# Altium project 主板.PrjPcb
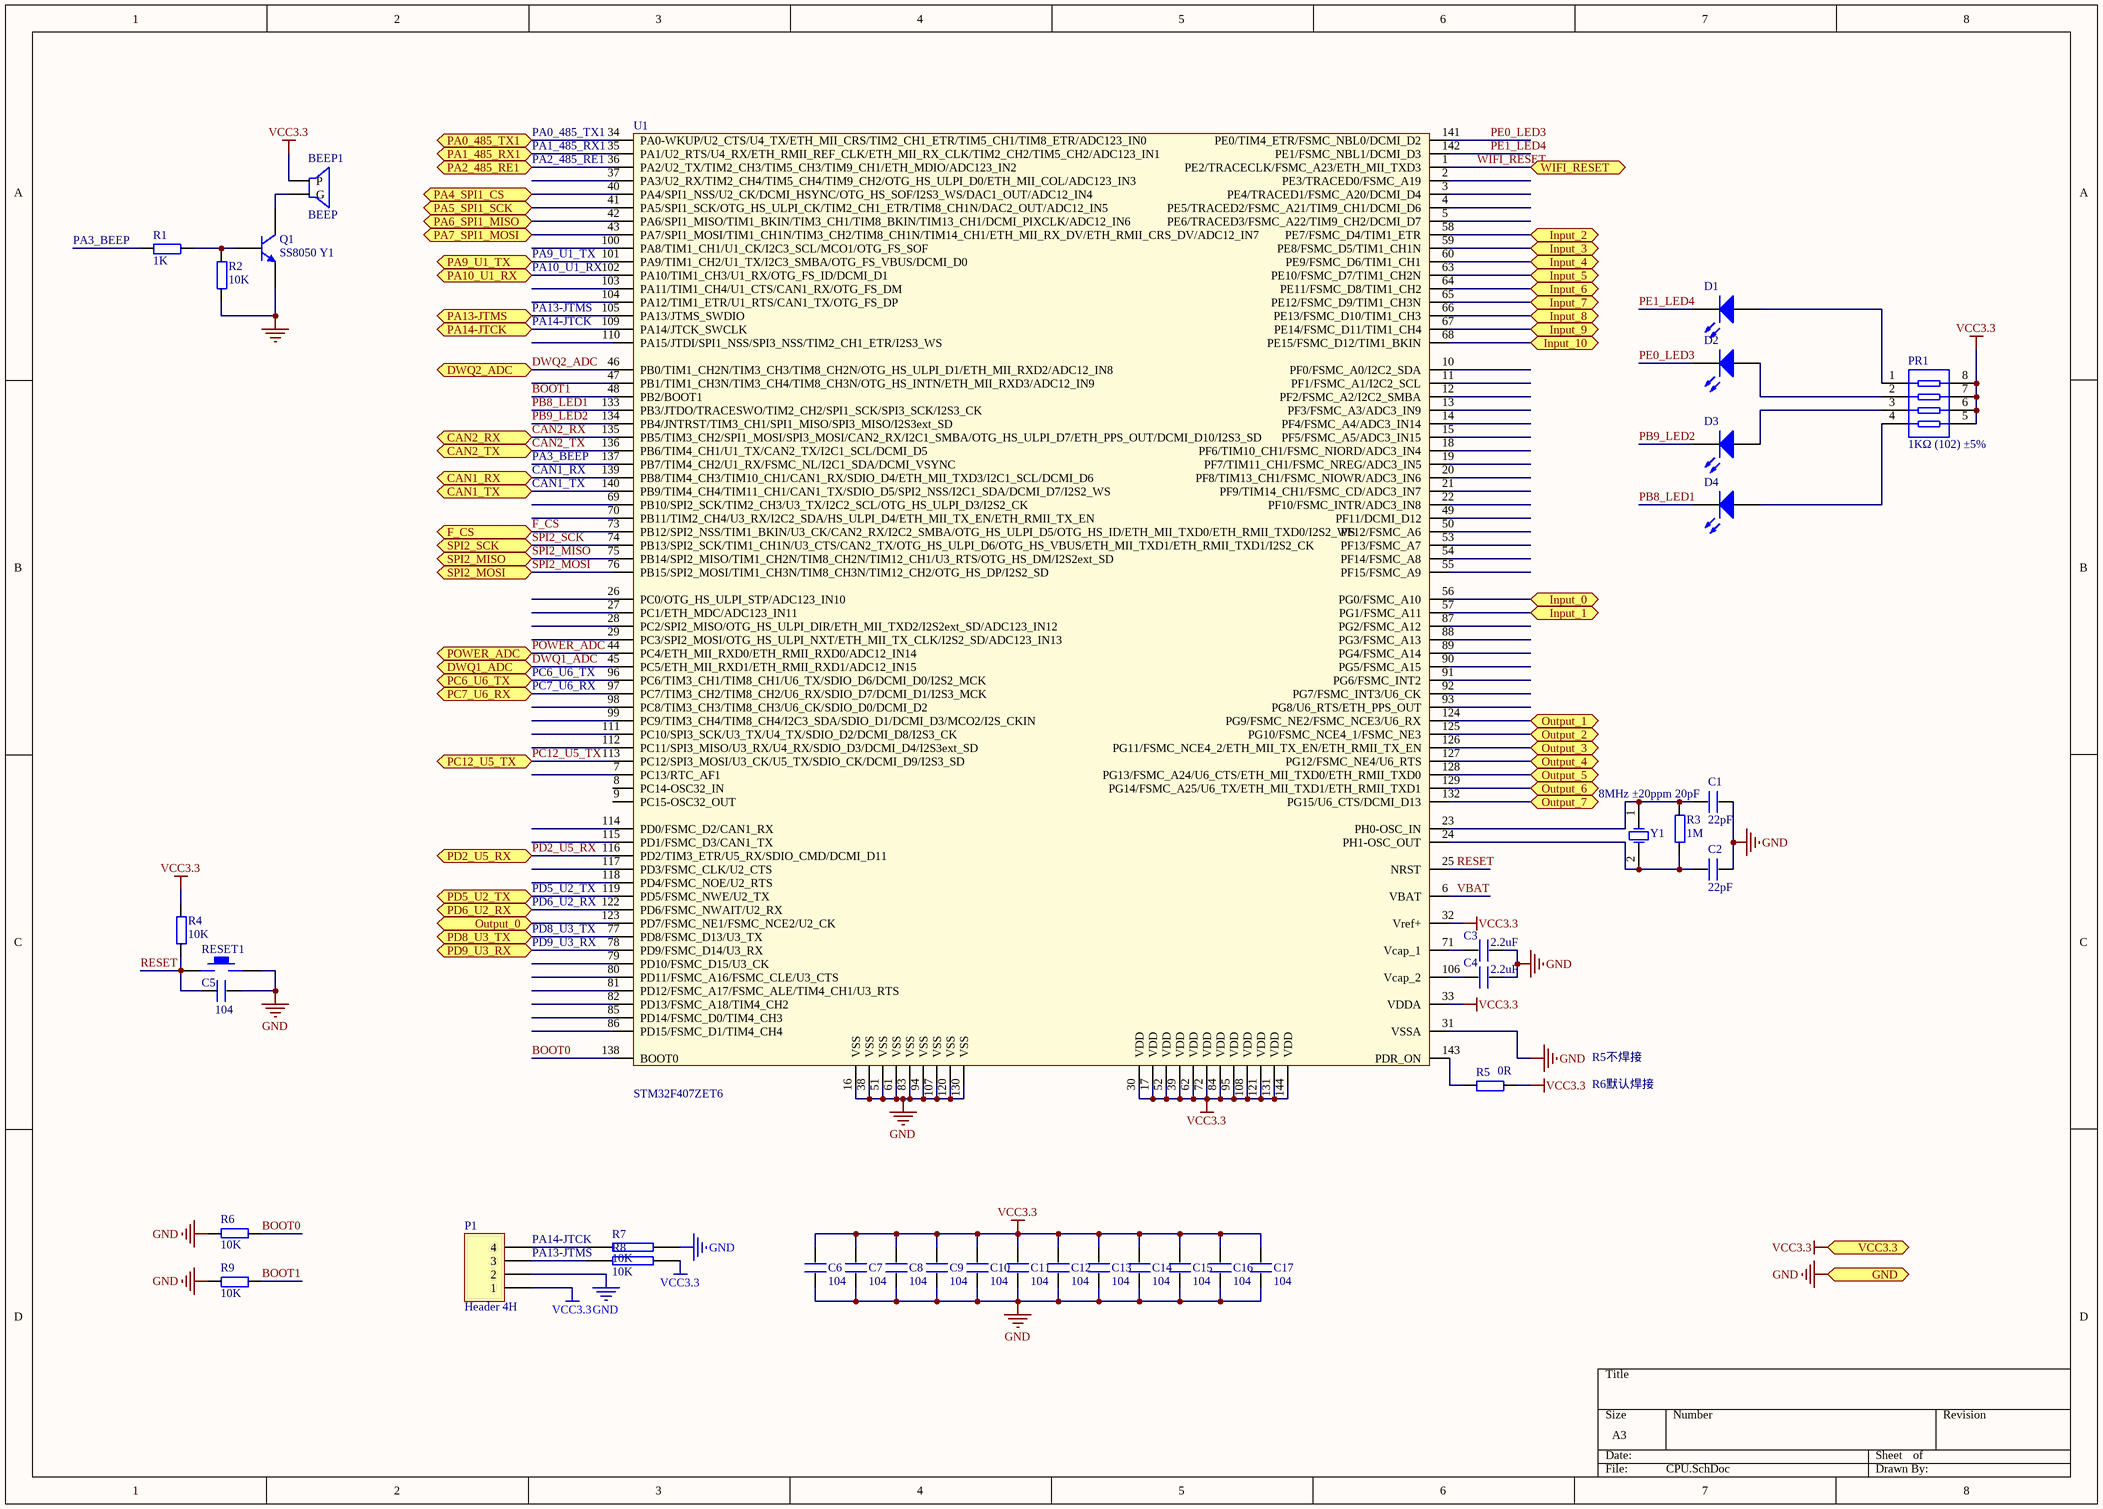
[diagram p0: CPU.SchDoc]
6 sheets, 286 parts. Net scope: flat (ports and power ports of the same name join across sheets).
Board file: PCB1.PcbDoc
Sheets:
  CPU.SchDoc
  通讯外设.SchDoc
  IO.SchDoc
  电源.SchDoc
  语音.SchDoc
  端子图.SchDoc

## Sheet CPU.SchDoc
size A3

### Parts
BEEP1  BEEP  [BELL-5]
C1  22pF  [0603_C]
C2  22pF  [0603_C]
C3  2.2uF  [0603_C]
C4  2.2uF  [0603_C]
C5  104  [0603_C]
C6  104  [0603_C]
C7  104  [0603_C]
C8  104  [0603_C]
C9  104  [0603_C]
C10  104  [0603_C]
C11  104  [0603_C]
C12  104  [0603_C]
C13  104  [0603_C]
C14  104  [0603_C]
C15  104  [0603_C]
C16  104  [0603_C]
C17  104  [0603_C]
D1  红灯 0805  [LC-0805_LED_S1]  (value not drawn)
D2  红灯 0805  [LC-0805_LED_S1]  (value not drawn)
D3  红灯 0805  [LC-0805_LED_S1]  (value not drawn)
D4  红灯 0805  [LC-0805_LED_S1]  (value not drawn)
P1  Header 4H  [IDE4]
PR1  1KΩ (102) ±5%  [0603_Rx4]
Q1  SS8050 Y1  [SOT-23(SOT-23-3)]
R1  1K  [0603_R]
R2  10K  [0603_R]
R3  1M  [0603_R]
R4  10K  [0603_R]
R5  0R  [0603_R]
R6  10K  [0603_R]
R7  10K  [0603_R]
R8  10K  [0603_R]
R9  10K  [0603_R]
RESET1  KEY_M  [SW_PB2_A1]  (value not drawn)
U1  STM32F407ZET6  [LQFP-144_20x20x05P]
Y1  8MHz ±20ppm 20pF  [SMD-5032_2P]

### Ports
CAN1_RX, CAN1_TX, CAN2_RX, CAN2_TX, DWQ1_ADC, DWQ2_ADC, F_CS, GND, Input_0, Input_1, Input_2, Input_3, Input_4, Input_5, Input_6, Input_7, Input_8, Input_9, Input_10, Output_0, Output_1, Output_2, Output_3, Output_4, Output_5, Output_6, Output_7, PA0_485_TX1, PA1_485_RX1, PA2_485_RE1, PA4_SPI1_CS, PA5_SPI1_SCK, PA6_SPI1_MISO, PA7_SPI1_MOSI, PA9_U1_TX, PA10_U1_RX, PA13-JTMS, PA14-JTCK, PC6_U6_TX, PC7_U6_RX, PC12_U5_TX, PD2_U5_RX, PD5_U2_TX, PD6_U2_RX, PD8_U3_TX, PD9_U3_RX, POWER_ADC, SPI2_MISO, SPI2_MOSI, SPI2_SCK, VCC3.3, WIFI_RESET

### Nets
GND: C1.1 C2.1 C3.2 C4.2 C5.2 C6.1 C7.1 C8.1 C9.1 C10.1 C11.1 C12.1 C13.1 C14.1 C15.1 C16.1 C17.1 P1.2 Q1.2(E) R2.1 R6.2 R7.1 R9.1 RESET1.2 U1.16(VSS) U1.31(VSSA) U1.38(VSS) U1.51(VSS) U1.61(VSS) U1.83(VSS) U1.94(VSS) U1.107(VSS) U1.120(VSS) U1.130(VSS) ; port GND
VCC3.3: BEEP1.1(P) C6.2 C7.2 C8.2 C9.2 C10.2 C11.2 C12.2 C13.2 C14.2 C15.2 C16.2 C17.2 P1.1 PR1.5 PR1.6 PR1.7 PR1.8 R4.2 R5.2 R8.1 U1.17(VDD) U1.30(VDD) U1.32(Vref+) U1.33(VDDA) U1.39(VDD) U1.52(VDD) U1.62(VDD) U1.72(VDD) U1.84(VDD) U1.95(VDD) U1.108(VDD) U1.121(VDD) U1.131(VDD) U1.144(VDD) ; port VCC3.3
BOOT0: R6.1 U1.138(BOOT0)
BOOT1: R9.2 U1.48(PB2/BOOT1)
CAN1_RX: U1.139(PB8/TIM4_CH3/TIM10_CH1/CAN1_RX/SDIO_D4/ETH_MII_TXD3/I2C1_SCL/DCMI_D6) ; port CAN1_RX
CAN1_TX: U1.140(PB9/TIM4_CH4/TIM11_CH1/CAN1_TX/SDIO_D5/SPI2_NSS/I2C1_SDA/DCMI_D7/I2S2_WS) ; port CAN1_TX
CAN2_RX: U1.135(PB5/TIM3_CH2/SPI1_MOSI/SPI3_MOSI/CAN2_RX/I2C1_SMBA/OTG_HS_ULPI_D7/ETH_PPS_OUT/DCMI_D10/I2S3_SD) ; port CAN2_RX
CAN2_TX: U1.136(PB6/TIM4_CH1/U1_TX/CAN2_TX/I2C1_SCL/DCMI_D5) ; port CAN2_TX
DWQ1_ADC: U1.45(PC5/ETH_MII_RXD1/ETH_RMII_RXD1/ADC12_IN15) ; port DWQ1_ADC
DWQ2_ADC: U1.46(PB0/TIM1_CH2N/TIM3_CH3/TIM8_CH2N/OTG_HS_ULPI_D1/ETH_MII_RXD2/ADC12_IN8) ; port DWQ2_ADC
F_CS: U1.73(PB12/SPI2_NSS/TIM1_BKIN/U3_CK/CAN2_RX/I2C2_SMBA/OTG_HS_ULPI_D5/OTG_HS_ID/ETH_MII_TXD0/ETH_RMII_TXD0/I2S2_WS) ; port F_CS
PA0_485_TX1: U1.34(PA0-WKUP/U2_CTS/U4_TX/ETH_MII_CRS/TIM2_CH1_ETR/TIM5_CH1/TIM8_ETR/ADC123_IN0) ; port PA0_485_TX1
PA1_485_RX1: U1.35(PA1/U2_RTS/U4_RX/ETH_RMII_REF_CLK/ETH_MII_RX_CLK/TIM2_CH2/TIM5_CH2/ADC123_IN1) ; port PA1_485_RX1
PA2_485_RE1: U1.36(PA2/U2_TX/TIM2_CH3/TIM5_CH3/TIM9_CH1/ETH_MDIO/ADC123_IN2) ; port PA2_485_RE1
PA3_BEEP: R1.1 U1.137(PB7/TIM4_CH2/U1_RX/FSMC_NL/I2C1_SDA/DCMI_VSYNC)
PA9_U1_TX: U1.101(PA9/TIM1_CH2/U1_TX/I2C3_SMBA/OTG_FS_VBUS/DCMI_D0) ; port PA9_U1_TX
PA10_U1_RX: U1.102(PA10/TIM1_CH3/U1_RX/OTG_FS_ID/DCMI_D1) ; port PA10_U1_RX
PA13-JTMS: P1.3 R8.2 U1.105(PA13/JTMS_SWDIO) ; port PA13-JTMS
PA14-JTCK: P1.4 R7.2 U1.109(PA14/JTCK_SWCLK) ; port PA14-JTCK
PB8_LED1: D4.K U1.133(PB3/JTDO/TRACESWO/TIM2_CH2/SPI1_SCK/SPI3_SCK/I2S3_CK)
PB9_LED2: D3.K U1.134(PB4/JNTRST/TIM3_CH1/SPI1_MISO/SPI3_MISO/I2S3ext_SD)
PC6_U6_TX: U1.96(PC6/TIM3_CH1/TIM8_CH1/U6_TX/SDIO_D6/DCMI_D0/I2S2_MCK) ; port PC6_U6_TX
PC7_U6_RX: U1.97(PC7/TIM3_CH2/TIM8_CH2/U6_RX/SDIO_D7/DCMI_D1/I2S3_MCK) ; port PC7_U6_RX
PC12_U5_TX: U1.113(PC12/SPI3_MOSI/U3_CK/U5_TX/SDIO_CK/DCMI_D9/I2S3_SD) ; port PC12_U5_TX
PD2_U5_RX: U1.116(PD2/TIM3_ETR/U5_RX/SDIO_CMD/DCMI_D11) ; port PD2_U5_RX
PD5_U2_TX: U1.119(PD5/FSMC_NWE/U2_TX) ; port PD5_U2_TX
PD6_U2_RX: U1.122(PD6/FSMC_NWAIT/U2_RX) ; port PD6_U2_RX
PD8_U3_TX: U1.77(PD8/FSMC_D13/U3_TX) ; port PD8_U3_TX
PD9_U3_RX: U1.78(PD9/FSMC_D14/U3_RX) ; port PD9_U3_RX
PE0_LED3: D2.K U1.141(PE0/TIM4_ETR/FSMC_NBL0/DCMI_D2)
PE1_LED4: D1.K U1.142(PE1/FSMC_NBL1/DCMI_D3)
POWER_ADC: U1.44(PC4/ETH_MII_RXD0/ETH_RMII_RXD0/ADC12_IN14) ; port POWER_ADC
RESET: C5.1 R4.1 RESET1.1 U1.25(NRST)
SPI2_MISO: U1.75(PB14/SPI2_MISO/TIM1_CH2N/TIM8_CH2N/TIM12_CH1/U3_RTS/OTG_HS_DM/I2S2ext_SD) ; port SPI2_MISO
SPI2_MOSI: U1.76(PB15/SPI2_MOSI/TIM1_CH3N/TIM8_CH3N/TIM12_CH2/OTG_HS_DP/I2S2_SD) ; port SPI2_MOSI
SPI2_SCK: U1.74(PB13/SPI2_SCK/TIM1_CH1N/U3_CTS/CAN2_TX/OTG_HS_ULPI_D6/OTG_HS_VBUS/ETH_MII_TXD1/ETH_RMII_TXD1/I2S2_CK) ; port SPI2_SCK
VBAT: U1.6(VBAT)
WIFI_RESET: U1.1(PE2/TRACECLK/FSMC_A23/ETH_MII_TXD3) ; port WIFI_RESET
NetBEEP1_2: BEEP1.2(G) Q1.3(C)
NetC1_2: C1.2 R3.2 U1.23(PH0-OSC_IN) Y1.1(OSC1)
NetC2_2: C2.2 R3.1 U1.24(PH1-OSC_OUT) Y1.2(OSC2)
NetC3_1: C3.1 U1.71(Vcap_1)
NetC4_1: C4.1 U1.106(Vcap_2)
NetD1_A: D1.A PR1.1
NetD2_A: D2.A PR1.2
NetD3_A: D3.A PR1.3
NetD4_A: D4.A PR1.4
NetQ1_1: Q1.1(B) R1.2 R2.2
NetR5_1: R5.1 U1.143(PDR_ON)
NetR40_1: U1.56(PG0/FSMC_A10) ; port Input_0
NetR42_1: U1.66(PE13/FSMC_D10/TIM1_CH3) ; port Input_8
NetR46_1: U1.57(PG1/FSMC_A11) ; port Input_1
NetR48_1: U1.67(PE14/FSMC_D11/TIM1_CH4) ; port Input_9
NetR54_1: U1.58(PE7/FSMC_D4/TIM1_ETR) ; port Input_2
NetR56_1: U1.68(PE15/FSMC_D12/TIM1_BKIN) ; port Input_10
NetR60_1: U1.59(PE8/FSMC_D5/TIM1_CH1N) ; port Input_3
NetR68_1: U1.60(PE9/FSMC_D6/TIM1_CH1) ; port Input_4
NetR76_1: U1.63(PE10/FSMC_D7/TIM1_CH2N) ; port Input_5
NetR83_1: U1.64(PE11/FSMC_D8/TIM1_CH2) ; port Input_6
NetR86_1: U1.65(PE12/FSMC_D9/TIM1_CH3N) ; port Input_7
NetU1_40: U1.40(PA4/SPI1_NSS/U2_CK/DCMI_HSYNC/OTG_HS_SOF/I2S3_WS/DAC1_OUT/ADC12_IN4) ; port PA4_SPI1_CS
NetU1_41: U1.41(PA5/SPI1_SCK/OTG_HS_ULPI_CK/TIM2_CH1_ETR/TIM8_CH1N/DAC2_OUT/ADC12_IN5) ; port PA5_SPI1_SCK
NetU1_42: U1.42(PA6/SPI1_MISO/TIM1_BKIN/TIM3_CH1/TIM8_BKIN/TIM13_CH1/DCMI_PIXCLK/ADC12_IN6) ; port PA6_SPI1_MISO
NetU1_43: U1.43(PA7/SPI1_MOSI/TIM1_CH1N/TIM3_CH2/TIM8_CH1N/TIM14_CH1/ETH_MII_RX_DV/ETH_RMII_CRS_DV/ADC12_IN7) ; port PA7_SPI1_MOSI
NetU1_123: U1.123(PD7/FSMC_NE1/FSMC_NCE2/U2_CK) ; port Output_0
NetU1_124: U1.124(PG9/FSMC_NE2/FSMC_NCE3/U6_RX) ; port Output_1
NetU1_125: U1.125(PG10/FSMC_NCE4_1/FSMC_NE3) ; port Output_2
NetU1_126: U1.126(PG11/FSMC_NCE4_2/ETH_MII_TX_EN/ETH_RMII_TX_EN) ; port Output_3
NetU1_127: U1.127(PG12/FSMC_NE4/U6_RTS) ; port Output_4
NetU1_128: U1.128(PG13/FSMC_A24/U6_CTS/ETH_MII_TXD0/ETH_RMII_TXD0) ; port Output_5
NetU1_129: U1.129(PG14/FSMC_A25/U6_TX/ETH_MII_TXD1/ETH_RMII_TXD1) ; port Output_6
NetU1_132: U1.132(PG15/U6_CTS/DCMI_D13) ; port Output_7

Not connected (* = marked no-connect by the designer): U1 2(PE3/TRACED0/FSMC_A19) 3(PE4/TRACED1/FSMC_A20/DCMI_D4) 4(PE5/TRACED2/FSMC_A21/TIM9_CH1/DCMI_D6) 5(PE6/TRACED3/FSMC_A22/TIM9_CH2/DCMI_D7) 7(PC13/RTC_AF1) 8(PC14-OSC32_IN) 9(PC15-OSC32_OUT) 10(PF0/FSMC_A0/I2C2_SDA) 11(PF1/FSMC_A1/I2C2_SCL) 12(PF2/FSMC_A2/I2C2_SMBA) 13(PF3/FSMC_A3/ADC3_IN9) 14(PF4/FSMC_A4/ADC3_IN14) 15(PF5/FSMC_A5/ADC3_IN15) 18(PF6/TIM10_CH1/FSMC_NIORD/ADC3_IN4) 19(PF7/TIM11_CH1/FSMC_NREG/ADC3_IN5) 20(PF8/TIM13_CH1/FSMC_NIOWR/ADC3_IN6) 21(PF9/TIM14_CH1/FSMC_CD/ADC3_IN7) 22(PF10/FSMC_INTR/ADC3_IN8) 26(PC0/OTG_HS_ULPI_STP/ADC123_IN10) 27(PC1/ETH_MDC/ADC123_IN11) 28(PC2/SPI2_MISO/OTG_HS_ULPI_DIR/ETH_MII_TXD2/I2S2ext_SD/ADC123_IN12) 29(PC3/SPI2_MOSI/OTG_HS_ULPI_NXT/ETH_MII_TX_CLK/I2S2_SD/ADC123_IN13) 37(PA3/U2_RX/TIM2_CH4/TIM5_CH4/TIM9_CH2/OTG_HS_ULPI_D0/ETH_MII_COL/ADC123_IN3) 47(PB1/TIM1_CH3N/TIM3_CH4/TIM8_CH3N/OTG_HS_INTN/ETH_MII_RXD3/ADC12_IN9) 49(PF11/DCMI_D12) 50(PF12/FSMC_A6) 53(PF13/FSMC_A7) 54(PF14/FSMC_A8) 55(PF15/FSMC_A9) 69(PB10/SPI2_SCK/TIM2_CH3/U3_TX/I2C2_SCL/OTG_HS_ULPI_D3/I2S2_CK) 70(PB11/TIM2_CH4/U3_RX/I2C2_SDA/HS_ULPI_D4/ETH_MII_TX_EN/ETH_RMII_TX_EN) 79(PD10/FSMC_D15/U3_CK) 80(PD11/FSMC_A16/FSMC_CLE/U3_CTS) 81(PD12/FSMC_A17/FSMC_ALE/TIM4_CH1/U3_RTS) 82(PD13/FSMC_A18/TIM4_CH2) 85(PD14/FSMC_D0/TIM4_CH3) 86(PD15/FSMC_D1/TIM4_CH4) 87(PG2/FSMC_A12) 88(PG3/FSMC_A13) 89(PG4/FSMC_A14) 90(PG5/FSMC_A15) 91(PG6/FSMC_INT2) 92(PG7/FSMC_INT3/U6_CK) 93(PG8/U6_RTS/ETH_PPS_OUT) 98(PC8/TIM3_CH3/TIM8_CH3/U6_CK/SDIO_D0/DCMI_D2) 99(PC9/TIM3_CH4/TIM8_CH4/I2C3_SDA/SDIO_D1/DCMI_D3/MCO2/I2S_CKIN) 100(PA8/TIM1_CH1/U1_CK/I2C3_SCL/MCO1/OTG_FS_SOF) 103(PA11/TIM1_CH4/U1_CTS/CAN1_RX/OTG_FS_DM) 104(PA12/TIM1_ETR/U1_RTS/CAN1_TX/OTG_FS_DP) 110(PA15/JTDI/SPI1_NSS/SPI3_NSS/TIM2_CH1_ETR/I2S3_WS) 111(PC10/SPI3_SCK/U3_TX/U4_TX/SDIO_D2/DCMI_D8/I2S3_CK) 112(PC11/SPI3_MISO/U3_RX/U4_RX/SDIO_D3/DCMI_D4/I2S3ext_SD) 114(PD0/FSMC_D2/CAN1_RX) 115(PD1/FSMC_D3/CAN1_TX) 117(PD3/FSMC_CLK/U2_CTS) 118(PD4/FSMC_NOE/U2_RTS)

### Notes on the sheet
- R5不焊接
- R6默认焊接

### Library data of the parts
C1 C2 = C_3
C3-C17 = C
D1-D4 = LED0: Typical INFRARED GaAs LED; Published: 8-Jun-2000; LatestRevisionDate: 08-Jul-2005; LatestRevisionNote: Mech Layer 1 removed.; PackageReference: LED-0; Publisher: Altium Limited; PackageDescription: LED; 2 Leads
P1 = Header 4H: Header, 4-Pin, Right Angle; LatestRevisionDate: 17-Jul-2002; LatestRevisionNote: Re-released for DXP Platform.; Publisher: Altium Limited
PR1 = 0603*4  1KΩ (102) 5%: 贴片排阻; ComponentLink1Description: 供应商链接; ComponentLink1URL: http://www.szlcsc.com/product/details_20907.html; Package: 0603*4; Supplier: LC; SuppliersPartNumber: C20197
Q1 = SOT-23 SS8050 Y1: 三极管; ComponentLink1Description: 供应商链接; ComponentLink1URL: http://www.szlcsc.com/product/details_2507.html; Package: SOT-23; Supplier: LC; SuppliersPartNumber: C2150
R1-R3 = R
R4 R5 = R_2
R6 R9 = R_1
R7 R8 = RES2
Y1 = SMD-5032_2P 8MHz 20ppm 20pF: 贴片晶振; ComponentLink1Description: 供应商链接; ComponentLink1URL: http://www.szlcsc.com/product/details_117214.html; Package: SMD-5032_2P; Supplier: LC; SuppliersPartNumber: C115962

## Sheet 通讯外设.SchDoc
size A3
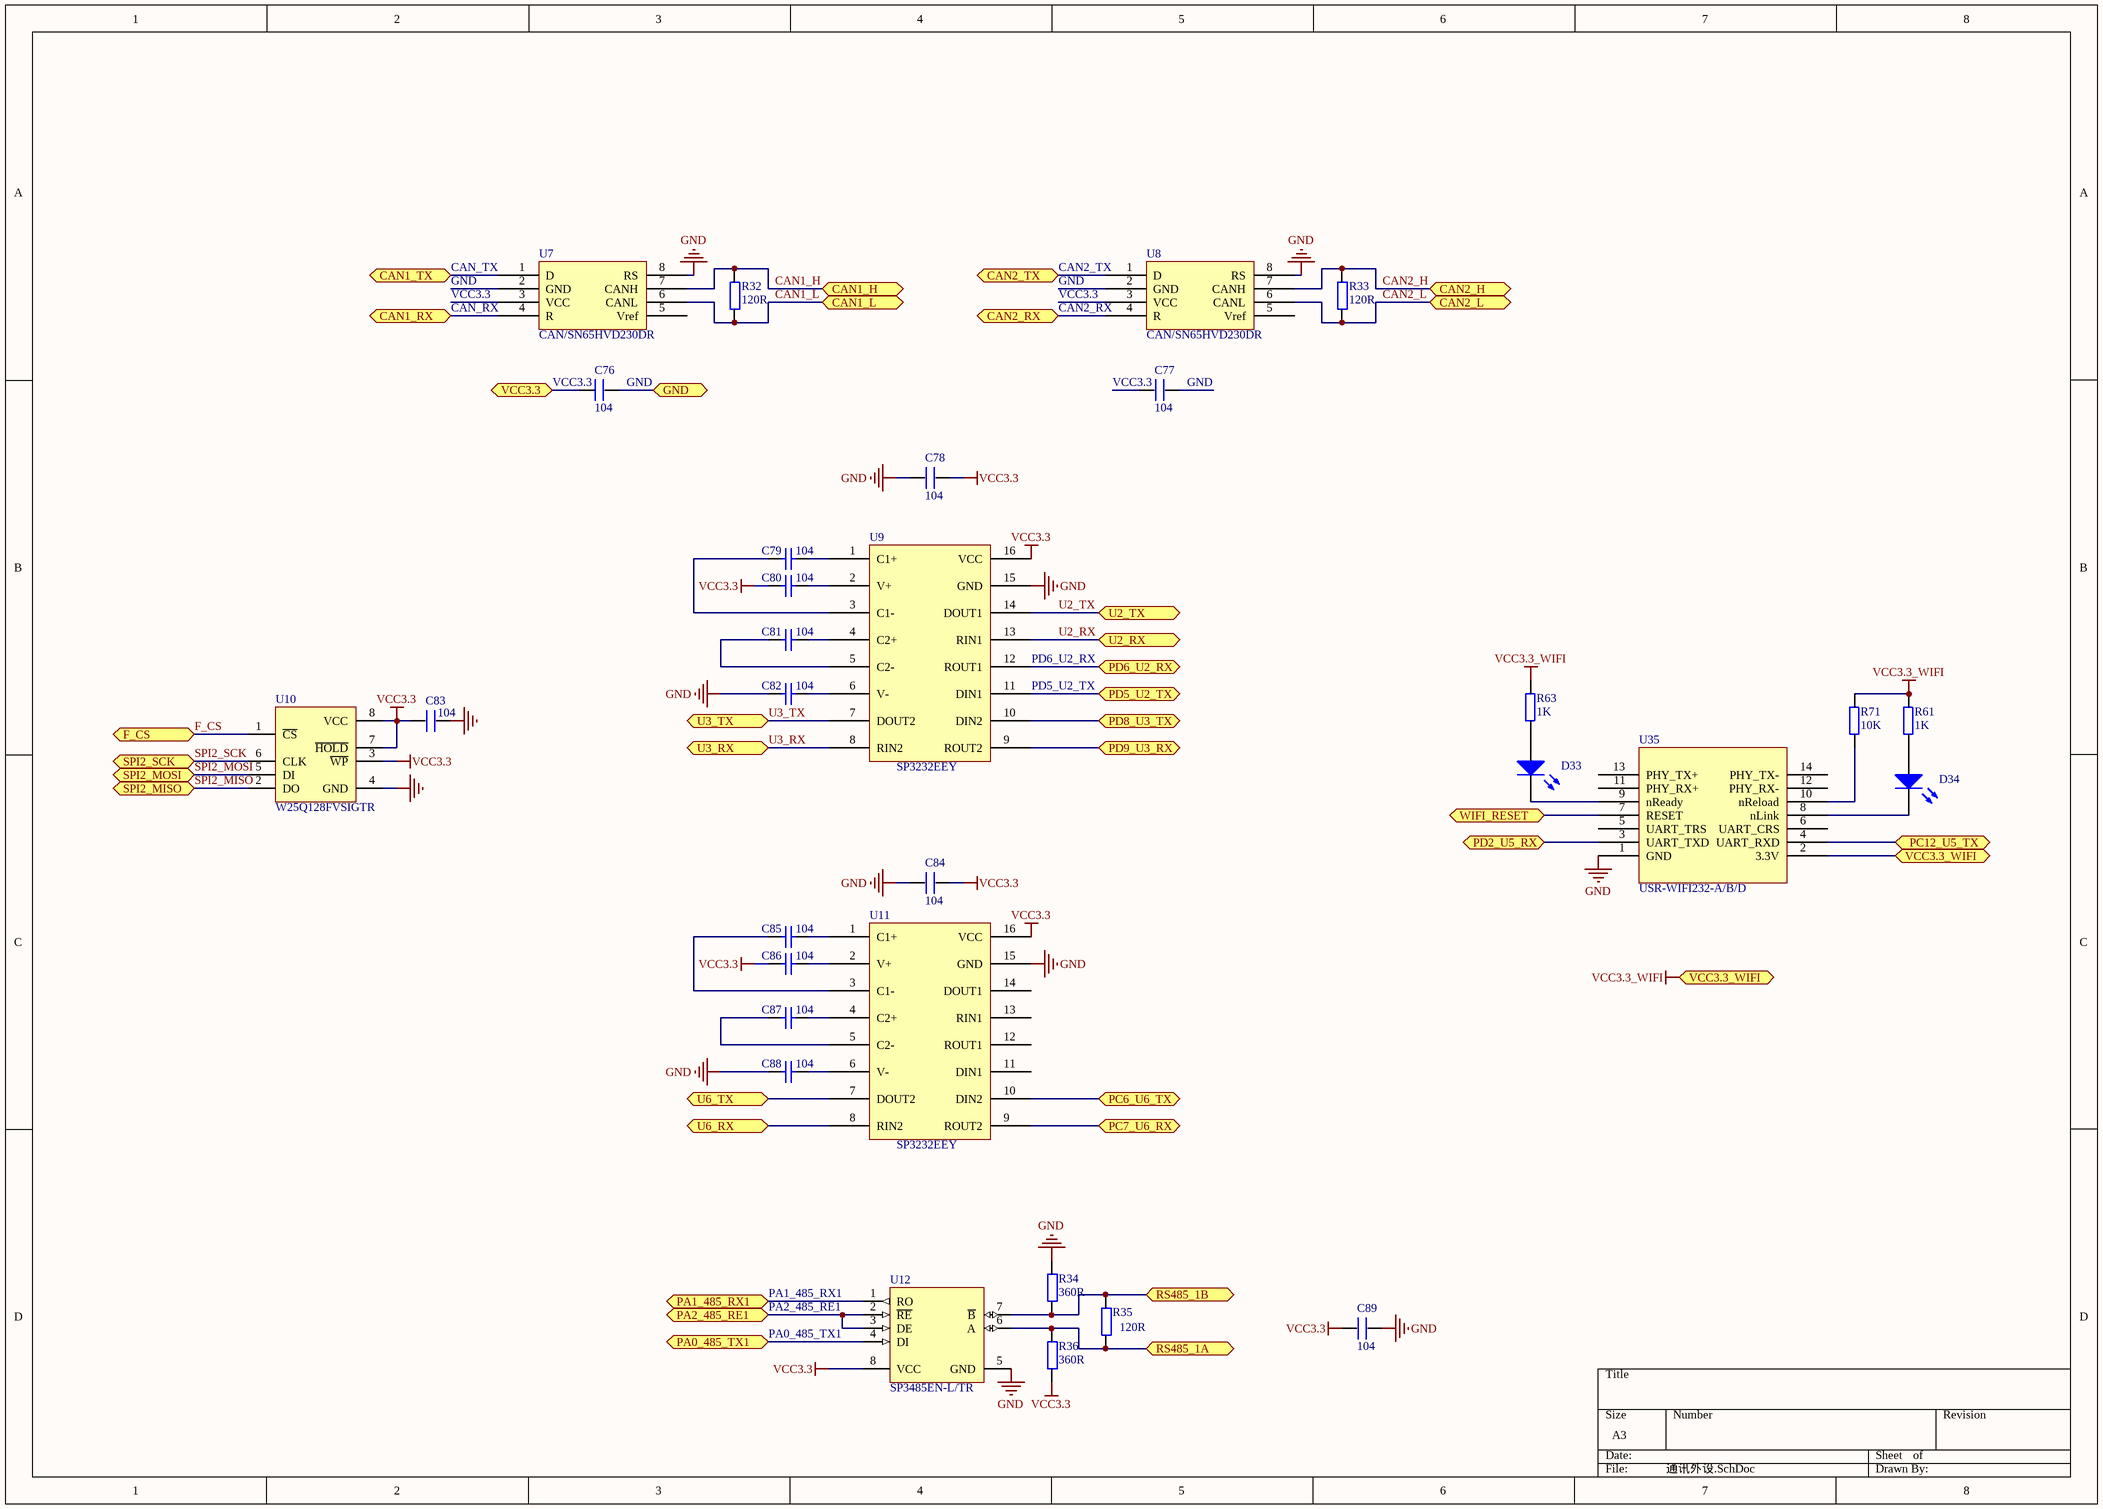
[diagram p1: 通讯外设.SchDoc]

### Parts
C76  104  [0603_C]
C77  104  [0603_C]
C78  104  [0603_C]
C79  value 104  [0603_C]  (hidden comment: 0.1uF)
C80  value 104  [0603_C]  (hidden comment: 0.1uF)
C81  value 104  [0603_C]  (hidden comment: 0.1uF)
C82  value 104  [0603_C]  (hidden comment: 0.1uF)
C83  104  [0603_C]
C84  104  [0603_C]
C85  value 104  [0603_C]  (hidden comment: 0.1uF)
C86  value 104  [0603_C]  (hidden comment: 0.1uF)
C87  value 104  [0603_C]  (hidden comment: 0.1uF)
C88  value 104  [0603_C]  (hidden comment: 0.1uF)
C89  104  [0603_C]
D33  红灯 0805  [LC-0805_LED_S1]  (value not drawn)
D34  红灯 0805  [LC-0805_LED_S1]  (value not drawn)
R32  120R  [0603_R]
R33  120R  [0603_R]
R34  360R  [0603_R]
R35  120R  [0603_R]
R36  360R  [0603_R]
R61  1K  [0603_R]
R63  1K  [0603_R]
R71  10K  [0603_R]
U7  CAN/SN65HVD230DR  [SOIC-8_150mil]
U8  CAN/SN65HVD230DR  [SOIC-8_150mil]
U9  SP3232EEY  [TSSOP-16]
U10  W25Q128FVSIGTR  [SOIC8_W]
U11  SP3232EEY  [TSSOP-16]
U12  SP3485EN-L/TR  [SOIC-8_150mil]
U35  USR-WIFI232-A/B/D  [USR-WIFI232-A/B/D]

### Ports
CAN1_H, CAN1_L, CAN1_RX, CAN1_TX, CAN2_H, CAN2_L, CAN2_RX, CAN2_TX, F_CS, GND, PA0_485_TX1, PA1_485_RX1, PA2_485_RE1, PC6_U6_TX, PC7_U6_RX, PC12_U5_TX, PD2_U5_RX, PD5_U2_TX, PD6_U2_RX, PD8_U3_TX, PD9_U3_RX, RS485_1A, RS485_1B, SPI2_MISO, SPI2_MOSI, SPI2_SCK, U2_RX, U2_TX, U3_RX, U3_TX, U6_RX, U6_TX, VCC3.3, VCC3.3_WIFI, WIFI_RESET

### Nets
GND: C76.2 C77.2 C78.1 C82.2 C83.2 C84.1 C88.2 C89.2 R34.2 U7.2(GND) U7.8(RS) U8.2(GND) U8.8(RS) U9.15(GND) U10.4(GND) U11.15(GND) U12.5(GND) U35.1(GND) ; port GND
VCC3.3: C76.1 C77.1 C78.2 C80.2 C83.1 C84.2 C86.2 C89.1 R36.1 U7.3(VCC) U8.3(VCC) U9.16(VCC) U10.3(~{WP}) U10.7(~{HOLD}) U10.8(VCC) U11.16(VCC) U12.8(VCC) ; port VCC3.3
VCC3.3_WIFI: R61.1 R63.1 R71.1 U35.2(3.3V) ; port VCC3.3_WIFI
CAN1_H: R32.2 U7.7(CANH) ; port CAN1_H
CAN1_L: R32.1 U7.6(CANL) ; port CAN1_L
CAN2_H: R33.2 U8.7(CANH) ; port CAN2_H
CAN2_L: R33.1 U8.6(CANL) ; port CAN2_L
CAN2_RX: U8.4(R) ; port CAN2_RX
CAN2_TX: U8.1(D) ; port CAN2_TX
CAN_RX: U7.4(R) ; port CAN1_RX  [project net CAN1_RX]
CAN_TX: U7.1(D) ; port CAN1_TX  [project net CAN1_TX]
F_CS: U10.1(~{CS}) ; port F_CS
PA0_485_TX1: U12.4(DI) ; port PA0_485_TX1
PA1_485_RX1: U12.1(RO) ; port PA1_485_RX1
PA2_485_RE1: U12.2(~{RE}) U12.3(DE) ; port PA2_485_RE1
PC6_U6_TX: U11.10(DIN2) ; port PC6_U6_TX
PC7_U6_RX: U11.9(ROUT2) ; port PC7_U6_RX
PC12_U5_TX: U35.4(UART_RXD) ; port PC12_U5_TX
PD2_U5_RX: U35.3(UART_TXD) ; port PD2_U5_RX
PD5_U2_TX: U9.11(DIN1) ; port PD5_U2_TX
PD6_U2_RX: U9.12(ROUT1) ; port PD6_U2_RX
PD8_U3_TX: U9.10(DIN2) ; port PD8_U3_TX
PD9_U3_RX: U9.9(ROUT2) ; port PD9_U3_RX
SPI2_MISO: U10.2(DO) ; port SPI2_MISO
SPI2_MOSI: U10.5(DI) ; port SPI2_MOSI
SPI2_SCK: U10.6(CLK) ; port SPI2_SCK
U2_RX: U9.13(RIN1) ; port U2_RX
U2_TX: U9.14(DOUT1) ; port U2_TX
U3_RX: U9.8(RIN2) ; port U3_RX
U3_TX: U9.7(DOUT2) ; port U3_TX
WIFI_RESET: U35.7(RESET) ; port WIFI_RESET
NetC79_1: C79.1 U9.1(C1+)
NetC79_2: C79.2 U9.3(C1-)
NetC80_1: C80.1 U9.2(V+)
NetC81_1: C81.1 U9.4(C2+)
NetC81_2: C81.2 U9.5(C2-)
NetC82_1: C82.1 U9.6(V-)
NetC85_1: C85.1 U11.1(C1+)
NetC85_2: C85.2 U11.3(C1-)
NetC86_1: C86.1 U11.2(V+)
NetC87_1: C87.1 U11.4(C2+)
NetC87_2: C87.2 U11.5(C2-)
NetC88_1: C88.1 U11.6(V-)
NetD33_A: D33.A R63.2
NetD33_K: D33.K U35.9(nReady)
NetD34_A: D34.A R61.2
NetD34_K: D34.K U35.8(nLink)
NetJ2_2: U11.8(RIN2) ; port U6_RX
NetJ2_3: U11.7(DOUT2) ; port U6_TX
NetP4_1: R34.1 R35.2 U12.7(~{B}) ; port RS485_1B
NetP4_2: R35.1 R36.2 U12.6(A) ; port RS485_1A
NetR71_2: R71.2 U35.10(nReload)

Not connected (* = marked no-connect by the designer): U7 5(Vref); U8 5(Vref); U11 11(DIN1) 12(ROUT1) 13(RIN1) 14(DOUT1); U35 5(UART_TRS) 6(UART_CRS) 11(PHY_RX+) 12(PHY_RX-) 13(PHY_TX+) 14(PHY_TX-)

### Library data of the parts
C76 C77 C89 = C_3
C78 C84 = C_2
C79-C82 C85-C88 = Cap: Capacitor; Published: 8-Jun-2000; LatestRevisionDate: 17-Jul-2002; LatestRevisionNote: Re-released for DXP Platform.; PackageReference: RAD-0.3; Publisher: Altium Limited; PackageDescription: Radial Cap, Thru-Hole; 2 Leads; 0.3 in Pin Spacing
C83 = C
D33 D34 = LED0: Typical INFRARED GaAs LED; Published: 8-Jun-2000; LatestRevisionDate: 08-Jul-2005; LatestRevisionNote: Mech Layer 1 removed.; PackageReference: LED-0; Publisher: Altium Limited; PackageDescription: LED; 2 Leads
R32-R36 R61 R63 R71 = R_2
U7 U8 = CAN/SN65HVD230DR: CAN; ComponentLink1Description: 供应商链接; ComponentLink1URL: http://www.szlcsc.com/product/details_12661.html; Package: SOIC-8_150mil; Supplier: LC; SuppliersPartNumber: C12084
U9 U11 = MAX3232CUE: RS232
U10 = W25QXX: Flash ROM; Memory: 64M bit
U12 = SP3485EN-L/TR: RS-485/RS-422; ComponentLink1Description: 供应商链接; ComponentLink1URL: http://www.szlcsc.com/product/details_9482.html; Package: SOIC-8; Supplier: LC; SuppliersPartNumber: C8963

## Sheet IO.SchDoc
size A3
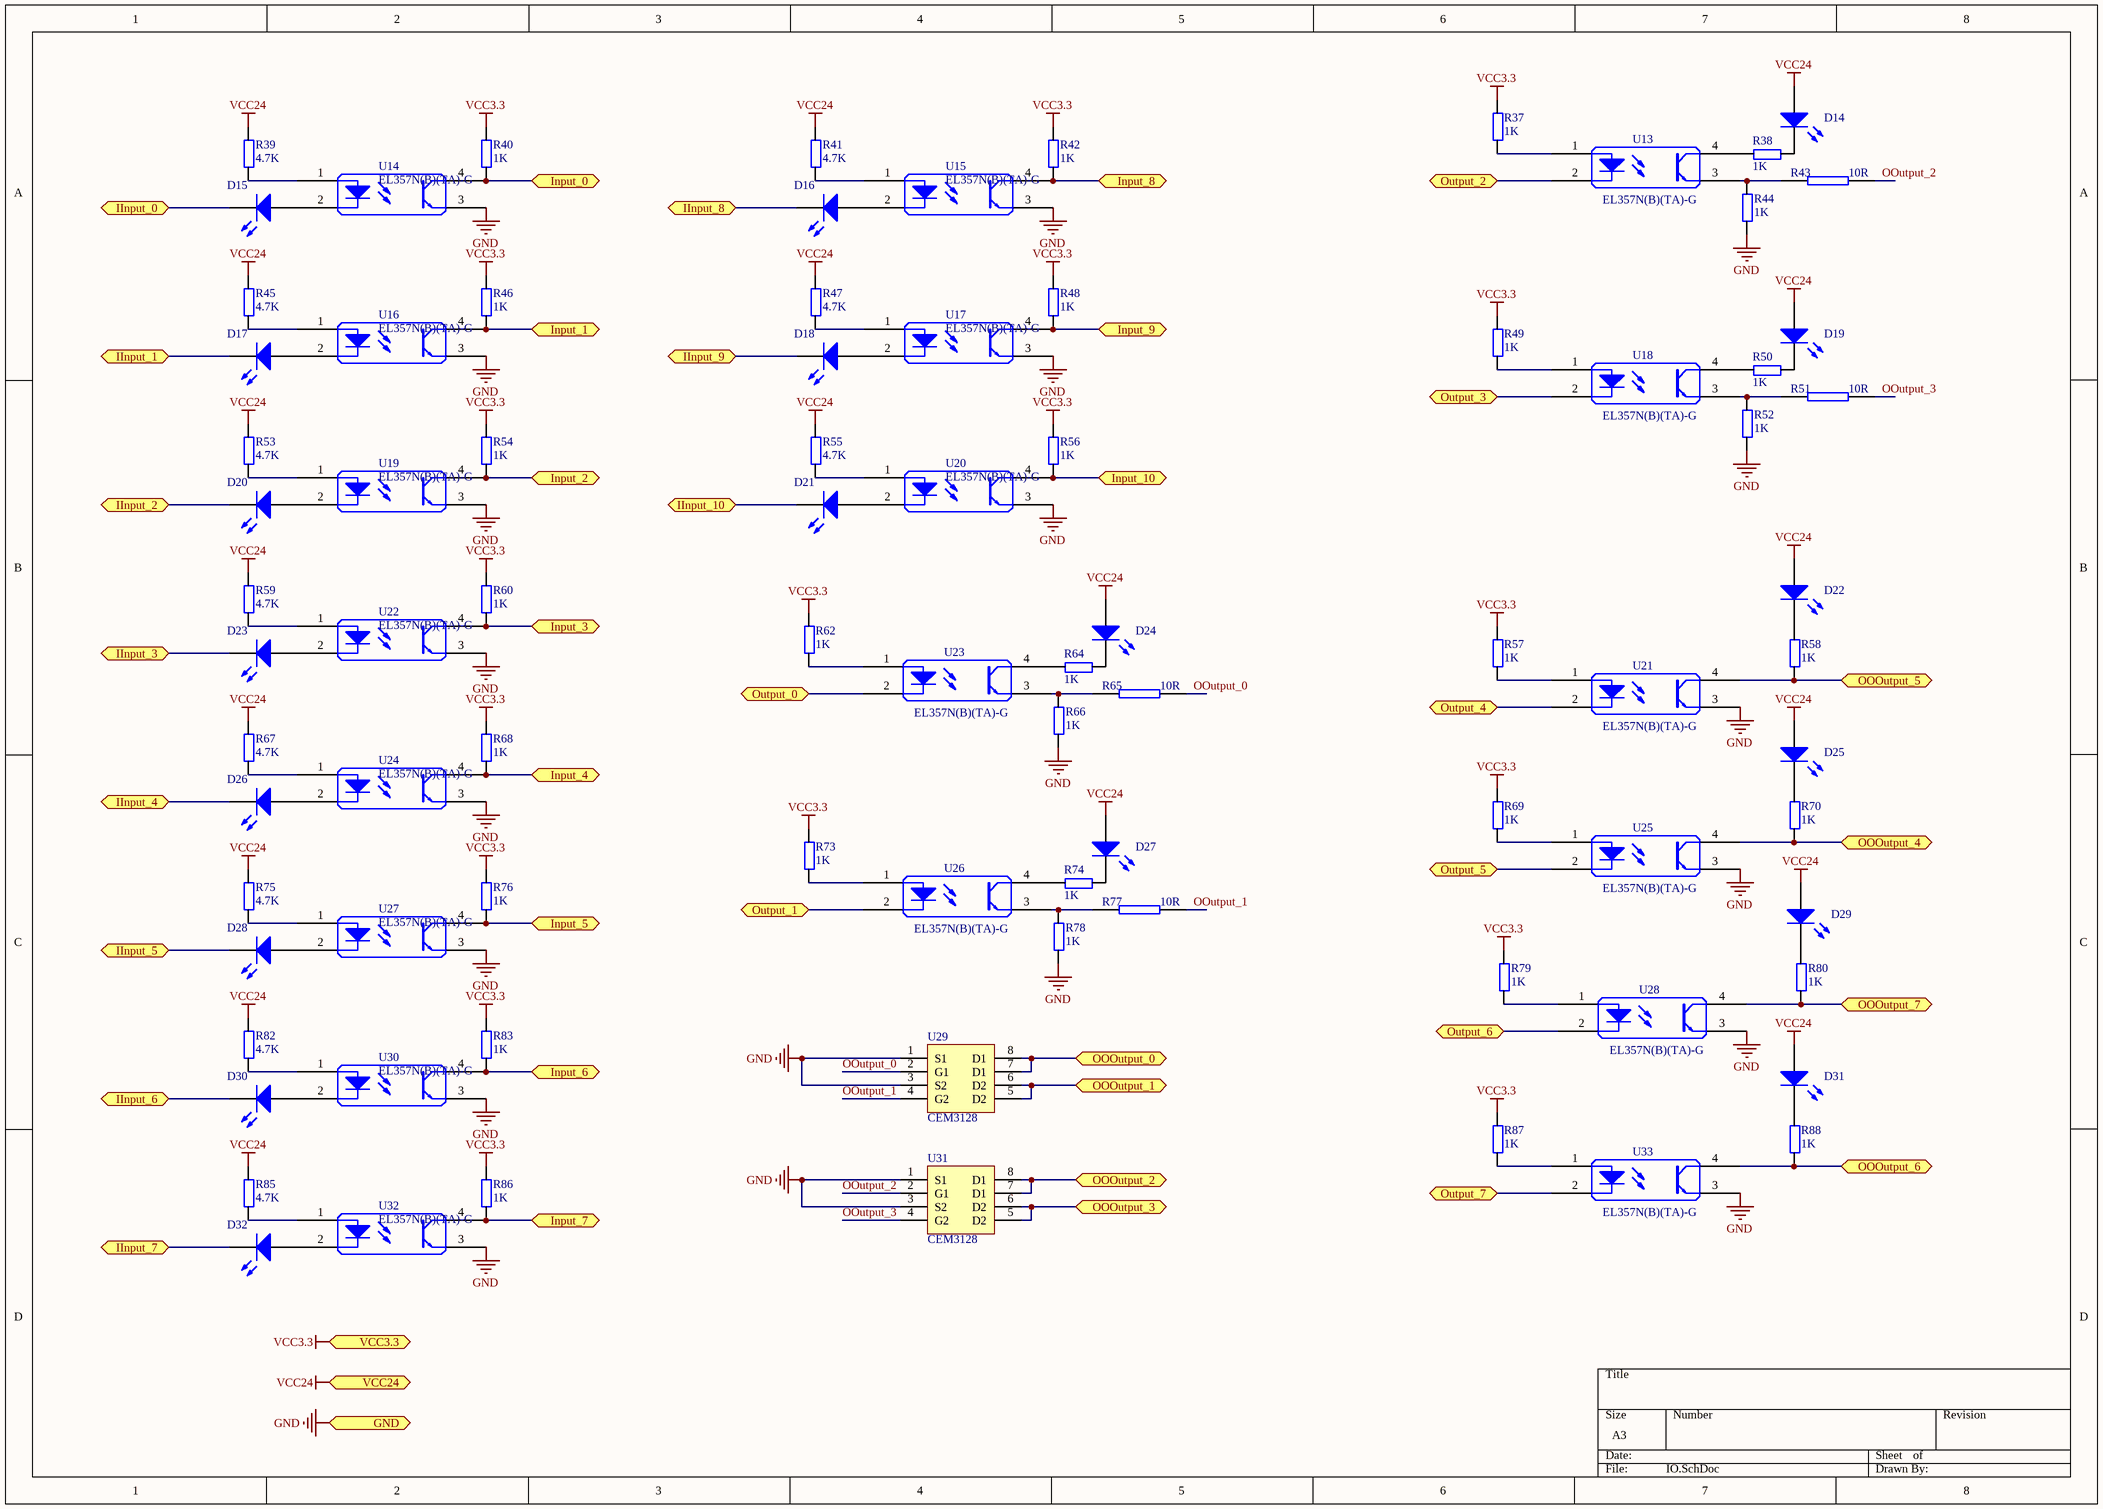
[diagram p2: IO.SchDoc]

### Parts
D14  红灯 0805  [LC-0805_LED_S1]  (value not drawn)
D15  红灯 0805  [LC-0805_LED_S1]  (value not drawn)
D16  红灯 0805  [LC-0805_LED_S1]  (value not drawn)
D17  红灯 0805  [LC-0805_LED_S1]  (value not drawn)
D18  红灯 0805  [LC-0805_LED_S1]  (value not drawn)
D19  红灯 0805  [LC-0805_LED_S1]  (value not drawn)
D20  红灯 0805  [LC-0805_LED_S1]  (value not drawn)
D21  红灯 0805  [LC-0805_LED_S1]  (value not drawn)
D22  红灯 0805  [LC-0805_LED_S1]  (value not drawn)
D23  红灯 0805  [LC-0805_LED_S1]  (value not drawn)
D24  红灯 0805  [LC-0805_LED_S1]  (value not drawn)
D25  红灯 0805  [LC-0805_LED_S1]  (value not drawn)
D26  红灯 0805  [LC-0805_LED_S1]  (value not drawn)
D27  红灯 0805  [LC-0805_LED_S1]  (value not drawn)
D28  红灯 0805  [LC-0805_LED_S1]  (value not drawn)
D29  红灯 0805  [LC-0805_LED_S1]  (value not drawn)
D30  红灯 0805  [LC-0805_LED_S1]  (value not drawn)
D31  红灯 0805  [LC-0805_LED_S1]  (value not drawn)
D32  红灯 0805  [LC-0805_LED_S1]  (value not drawn)
R37  1K  [0603_R]
R38  1K  [0603_R]
R39  4.7K  [0603_R]
R40  1K  [0603_R]
R41  4.7K  [0603_R]
R42  1K  [0603_R]
R43  10R  [0603_R]
R44  1K  [0603_R]
R45  4.7K  [0603_R]
R46  1K  [0603_R]
R47  4.7K  [0603_R]
R48  1K  [0603_R]
R49  1K  [0603_R]
R50  1K  [0603_R]
R51  10R  [0603_R]
R52  1K  [0603_R]
R53  4.7K  [0603_R]
R54  1K  [0603_R]
R55  4.7K  [0603_R]
R56  1K  [0603_R]
R57  1K  [0603_R]
R58  1K  [0603_R]
R59  4.7K  [0603_R]
R60  1K  [0603_R]
R62  1K  [0603_R]
R64  1K  [0603_R]
R65  10R  [0603_R]
R66  1K  [0603_R]
R67  4.7K  [0603_R]
R68  1K  [0603_R]
R69  1K  [0603_R]
R70  1K  [0603_R]
R73  1K  [0603_R]
R74  1K  [0603_R]
R75  4.7K  [0603_R]
R76  1K  [0603_R]
R77  10R  [0603_R]
R78  1K  [0603_R]
R79  1K  [0603_R]
R80  1K  [0603_R]
R82  4.7K  [0603_R]
R83  1K  [0603_R]
R85  4.7K  [0603_R]
R86  1K  [0603_R]
R87  1K  [0603_R]
R88  1K  [0603_R]
U13  EL357N(B)(TA)-G  [LC-SOP-4_P2.54]
U14  EL357N(B)(TA)-G  [LC-SOP-4_P2.54]
U15  EL357N(B)(TA)-G  [LC-SOP-4_P2.54]
U16  EL357N(B)(TA)-G  [LC-SOP-4_P2.54]
U17  EL357N(B)(TA)-G  [LC-SOP-4_P2.54]
U18  EL357N(B)(TA)-G  [LC-SOP-4_P2.54]
U19  EL357N(B)(TA)-G  [LC-SOP-4_P2.54]
U20  EL357N(B)(TA)-G  [LC-SOP-4_P2.54]
U21  EL357N(B)(TA)-G  [LC-SOP-4_P2.54]
U22  EL357N(B)(TA)-G  [LC-SOP-4_P2.54]
U23  EL357N(B)(TA)-G  [LC-SOP-4_P2.54]
U24  EL357N(B)(TA)-G  [LC-SOP-4_P2.54]
U25  EL357N(B)(TA)-G  [LC-SOP-4_P2.54]
U26  EL357N(B)(TA)-G  [LC-SOP-4_P2.54]
U27  EL357N(B)(TA)-G  [LC-SOP-4_P2.54]
U28  EL357N(B)(TA)-G  [LC-SOP-4_P2.54]
U29  CEM3128  [SO-8]
U30  EL357N(B)(TA)-G  [LC-SOP-4_P2.54]
U31  CEM3128  [SO-8]
U32  EL357N(B)(TA)-G  [LC-SOP-4_P2.54]
U33  EL357N(B)(TA)-G  [LC-SOP-4_P2.54]

### Ports
GND, IInput_0, IInput_1, IInput_2, IInput_3, IInput_4, IInput_5, IInput_6, IInput_7, IInput_8, IInput_9, IInput_10, Input_0, Input_1, Input_2, Input_3, Input_4, Input_5, Input_6, Input_7, Input_8, Input_9, Input_10, OOOutput_0, OOOutput_1, OOOutput_2, OOOutput_3, OOOutput_4, OOOutput_5, OOOutput_6, OOOutput_7, Output_0, Output_1, Output_2, Output_3, Output_4, Output_5, Output_6, Output_7, VCC3.3, VCC24

### Nets
GND: R44.1 R52.1 R66.1 R78.1 U14.3 U15.3 U16.3 U17.3 U19.3 U20.3 U21.3 U22.3 U24.3 U25.3 U27.3 U28.3 U29.1(S1) U29.3(S2) U30.3 U31.1(S1) U31.3(S2) U32.3 U33.3 ; port GND
VCC3.3: R37.2 R40.2 R42.2 R46.2 R48.2 R49.2 R54.2 R56.2 R57.2 R60.2 R62.2 R68.2 R69.2 R73.2 R76.2 R79.2 R83.2 R86.2 R87.2 ; port VCC3.3
VCC24: D14.A D19.A D22.A D24.A D25.A D27.A D29.A D31.A R39.2 R41.2 R45.2 R47.2 R53.2 R55.2 R59.2 R67.2 R75.2 R82.2 R85.2 ; port VCC24
OOutput_0: R65.1 U29.2(G1)
OOutput_1: R77.1 U29.4(G2)
OOutput_2: R43.1 U31.2(G1)
OOutput_3: R51.1 U31.4(G2)
NetD14_K: D14.K R38.2
NetD15_A: D15.A U14.2
NetD15_K: D15.K ; port IInput_0
NetD16_A: D16.A U15.2
NetD16_K: D16.K ; port IInput_8
NetD17_A: D17.A U16.2
NetD17_K: D17.K ; port IInput_1
NetD18_A: D18.A U17.2
NetD18_K: D18.K ; port IInput_9
NetD19_K: D19.K R50.2
NetD20_A: D20.A U19.2
NetD20_K: D20.K ; port IInput_2
NetD21_A: D21.A U20.2
NetD21_K: D21.K ; port IInput_10
NetD22_K: D22.K R58.2
NetD23_A: D23.A U22.2
NetD23_K: D23.K ; port IInput_3
NetD24_K: D24.K R64.2
NetD25_K: D25.K R70.2
NetD26_A: D26.A U24.2
NetD26_K: D26.K ; port IInput_4
NetD27_K: D27.K R74.2
NetD28_A: D28.A U27.2
NetD28_K: D28.K ; port IInput_5
NetD29_K: D29.K R80.2
NetD30_A: D30.A U30.2
NetD30_K: D30.K ; port IInput_6
NetD31_K: D31.K R88.2
NetD32_A: D32.A U32.2
NetD32_K: D32.K ; port IInput_7
NetP18_1: U29.5(D2) U29.6(D2) ; port OOOutput_1
NetP18_2: U29.7(D1) U29.8(D1) ; port OOOutput_0
NetP18_3: U31.5(D2) U31.6(D2) ; port OOOutput_3
NetP18_4: U31.7(D1) U31.8(D1) ; port OOOutput_2
NetP19_1: R58.1 U21.4 ; port OOOutput_5
NetP19_2: R70.1 U25.4 ; port OOOutput_4
NetP19_3: R80.1 U28.4 ; port OOOutput_7
NetP19_4: R88.1 U33.4 ; port OOOutput_6
NetR37_1: R37.1 U13.1
NetR38_1: R38.1 U13.4
NetR39_1: R39.1 U14.1
NetR40_1: R40.1 U14.4 ; port Input_0
NetR41_1: R41.1 U15.1
NetR42_1: R42.1 U15.4 ; port Input_8
NetR43_2: R43.2 R44.2 U13.3
NetR45_1: R45.1 U16.1
NetR46_1: R46.1 U16.4 ; port Input_1
NetR47_1: R47.1 U17.1
NetR48_1: R48.1 U17.4 ; port Input_9
NetR49_1: R49.1 U18.1
NetR50_1: R50.1 U18.4
NetR51_2: R51.2 R52.2 U18.3
NetR53_1: R53.1 U19.1
NetR54_1: R54.1 U19.4 ; port Input_2
NetR55_1: R55.1 U20.1
NetR56_1: R56.1 U20.4 ; port Input_10
NetR57_1: R57.1 U21.1
NetR59_1: R59.1 U22.1
NetR60_1: R60.1 U22.4 ; port Input_3
NetR62_1: R62.1 U23.1
NetR64_1: R64.1 U23.4
NetR65_2: R65.2 R66.2 U23.3
NetR67_1: R67.1 U24.1
NetR68_1: R68.1 U24.4 ; port Input_4
NetR69_1: R69.1 U25.1
NetR73_1: R73.1 U26.1
NetR74_1: R74.1 U26.4
NetR75_1: R75.1 U27.1
NetR76_1: R76.1 U27.4 ; port Input_5
NetR77_2: R77.2 R78.2 U26.3
NetR79_1: R79.1 U28.1
NetR82_1: R82.1 U30.1
NetR83_1: R83.1 U30.4 ; port Input_6
NetR85_1: R85.1 U32.1
NetR86_1: R86.1 U32.4 ; port Input_7
NetR87_1: R87.1 U33.1
NetU1_123: U23.2 ; port Output_0
NetU1_124: U26.2 ; port Output_1
NetU1_125: U13.2 ; port Output_2
NetU1_126: U18.2 ; port Output_3
NetU1_127: U21.2 ; port Output_4
NetU1_128: U25.2 ; port Output_5
NetU1_129: U28.2 ; port Output_6
NetU1_132: U33.2 ; port Output_7

### Library data of the parts
D14-D32 = LED0: Typical INFRARED GaAs LED; Published: 8-Jun-2000; LatestRevisionDate: 08-Jul-2005; LatestRevisionNote: Mech Layer 1 removed.; PackageReference: LED-0; Publisher: Altium Limited; PackageDescription: LED; 2 Leads
R37-R42 R44-R50 R52-R60 R62 R64 R66-R70 R73-R76 R78-R80 R82 R83 R85-R88 = R_2
R43 R51 R65 R77 = RES2
U13-U28 U30 U32 U33 = 2701
U29 U31 = AF4920N

## Sheet 电源.SchDoc
size A4
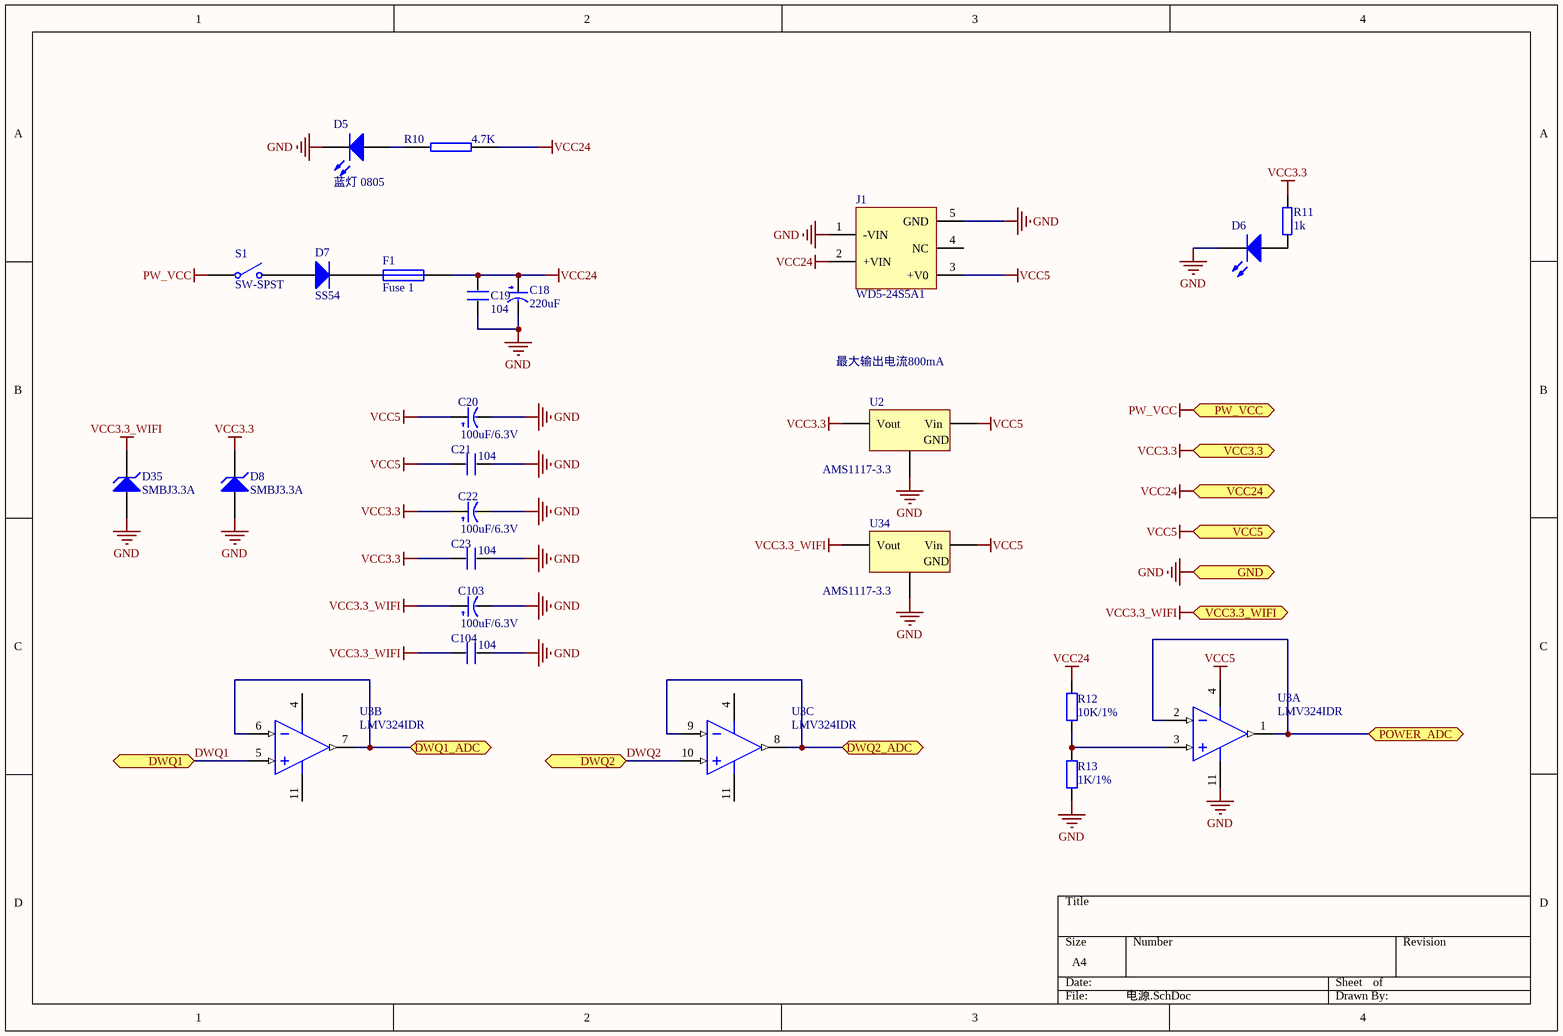
[diagram p3: 电源.SchDoc]

### Parts
C18  220uF  [CC6.56.5]
C19  104  [0805_C]
C20  100uF/6.3V  [CASE-B_3528]
C21  104  [0805_C]
C22  100uF/6.3V  [CASE-B_3528]
C23  104  [0805_C]
C103  100uF/6.3V  [CASE-B_3528]
C104  104  [0805_C]
D5  蓝灯 0805  [0805_LED_S1]
D6  蓝灯 0805  [LC-0805_LED_S1]  (value not drawn)
D7  SS54  [SMA(DO-214AC)_S1]
D8  SMBJ3.3A  [SMB(DO-214AA)_S1]
D35  SMBJ3.3A  [SMB(DO-214AA)_S1]
F1  Fuse 1  [1206]
J1  WD5-24S5A1  [WD5-24S3V3]
R10  4.7K  [0603_R]
R11  1k  [0805_R]
R12  10K/1%  [0805_R]
R13  1K/1%  [0805_R]
S1  SW-SPST  [SPST-2]
U2  AMS1117-3.3  [SOT-223]
U3  LMV324IDR  [SOIC-14_150mil]  (parts A,B,C of 4)
U34  AMS1117-3.3  [SOT-223]

### Ports
DWQ1, DWQ1_ADC, DWQ2, DWQ2_ADC, GND, POWER_ADC, PW_VCC, VCC3.3, VCC3.3_WIFI, VCC5, VCC24

### Nets
GND: C18.2(GND) C19.2 C20.2(GND) C21.1 C22.2(GND) C23.1 C103.2(GND) C104.1 D5.K D6.K D8.1(A) D35.1(A) J1.1(-VIN) J1.5(GND) R13.1 U2.1(GND) U3.11(V-) U34.1(GND) ; port GND
PW_VCC: S1.1(COMMON) ; port PW_VCC
VCC3.3: C22.1(VCC) C23.2 D8.2(K) R11.1 U2.2(Vout) ; port VCC3.3
VCC3.3_WIFI: C103.1(VCC) C104.2 D35.2(K) U34.2(Vout) ; port VCC3.3_WIFI
VCC5: C20.1(VCC) C21.2 J1.3(+V0) U2.3(Vin) U3.4(V+) U34.3(Vin) ; port VCC5
VCC24: C18.1(VCC) C19.1 F1.2 J1.2(+VIN) R10.1 R12.2 ; port VCC24
DWQ1: U3.5(INB+) ; port DWQ1
DWQ1_ADC: U3.6(INB-) U3.7(OUTB) ; port DWQ1_ADC
DWQ2: U3.10(INC+) ; port DWQ2
DWQ2_ADC: U3.8(OUTC) U3.9(INC-) ; port DWQ2_ADC
POWER_ADC: U3.1(OUTA) U3.2(INA-) ; port POWER_ADC
NetD5_A: D5.A R10.2
NetD6_A: D6.A R11.2
NetD7_1: D7.1(A) S1.2(NO)
NetD7_2: D7.2(K) F1.1
NetR12_1: R12.1 R13.2 U3.3(INA+)

Not connected (* = marked no-connect by the designer): J1 4(NC)

### Notes on the sheet
- 最大输出电流800mA

### Library data of the parts
C18 C20 C22 C103 = CAP
C19 C21 C23 C104 = C
D5 = 0805 蓝灯: 发光二极管; ComponentLink1Description: 供应商链接; ComponentLink1URL: http://www.szlcsc.com/product/details_2666.html; Package: 0805; Supplier: LC; SuppliersPartNumber: C2293
D6 = LED0: Typical INFRARED GaAs LED; Published: 8-Jun-2000; LatestRevisionDate: 08-Jul-2005; LatestRevisionNote: Mech Layer 1 removed.; PackageReference: LED-0; Publisher: Altium Limited; PackageDescription: LED; 2 Leads
D7 = SMA(DO-214AC) SS54: 二极管; ComponentLink1Description: 供应商链接; ComponentLink1URL: http://www.szlcsc.com/product/details_23178.html; Package: SMA(DO-214AC); Supplier: LC; SuppliersPartNumber: C22452
D8 D35 = D Zener: Zener Diode; Published: 8-Jun-2000; LatestRevisionDate: 17-Jul-2002; LatestRevisionNote: Re-released for DXP Platform.; PackageReference: DIODE-0.7; Publisher: Altium Limited; PackageDescription: Diode, Thru-Hole; 2 Leads; 0.7 in Pin Spacing
F1 = Fuse 1: Fuse; Published: 8-Jun-2000; LatestRevisionDate: 17-Jul-2002; LatestRevisionNote: Re-released for DXP Platform.; PackageReference: PIN-W2/E2.8; Publisher: Altium Limited; PackageDescription: Thru-Hole; 2 Leads
J1 = WD5-24S3V3A1
R10 = RES2
R11 = R_2
R12 = Res2: Resistor; Value: 10K; Published: 8-Jun-2000; LatestRevisionDate: 17-Jul-2002; LatestRevisionNote: Re-released for DXP Platform.; PackageReference: AXIAL-0.4; Publisher: Altium Limited; PackageDescription: Axial Device, Thru-Hole; 2 Leads; 0.4 in Pin Spacing
R13 = Res2: Resistor; Value: 1K; Published: 8-Jun-2000; LatestRevisionDate: 17-Jul-2002; LatestRevisionNote: Re-released for DXP Platform.; PackageReference: AXIAL-0.4; Publisher: Altium Limited; PackageDescription: Axial Device, Thru-Hole; 2 Leads; 0.4 in Pin Spacing
S1 = SW-SPST: Single-Pole, Single-Throw Switch; Published: 24-Mar-1999; LatestRevisionDate: 17-Jul-2002; LatestRevisionNote: Re-released for DXP Platform.; PackageReference: SPST-2; Publisher: Altium Limited; PackageDescription: Switch; 2 Leads
U2 U34 = SOT-223 AMS1117-3.3: 低压差线性稳压(LDO); ComponentLink1Description: 供应商链接; ComponentLink1URL: http://www.szlcsc.com/product/details_6652.html; Package: SOT-223; Supplier: LC; SuppliersPartNumber: C6186
U3 = LMV324IDR: 运放; ComponentLink1Description: 供应商链接; ComponentLink1URL: http://www.szlcsc.com/product/details_8451.html; Package: SOIC-14_150mil; Supplier: LC; SuppliersPartNumber: C7974

## Sheet 语音.SchDoc
size A3
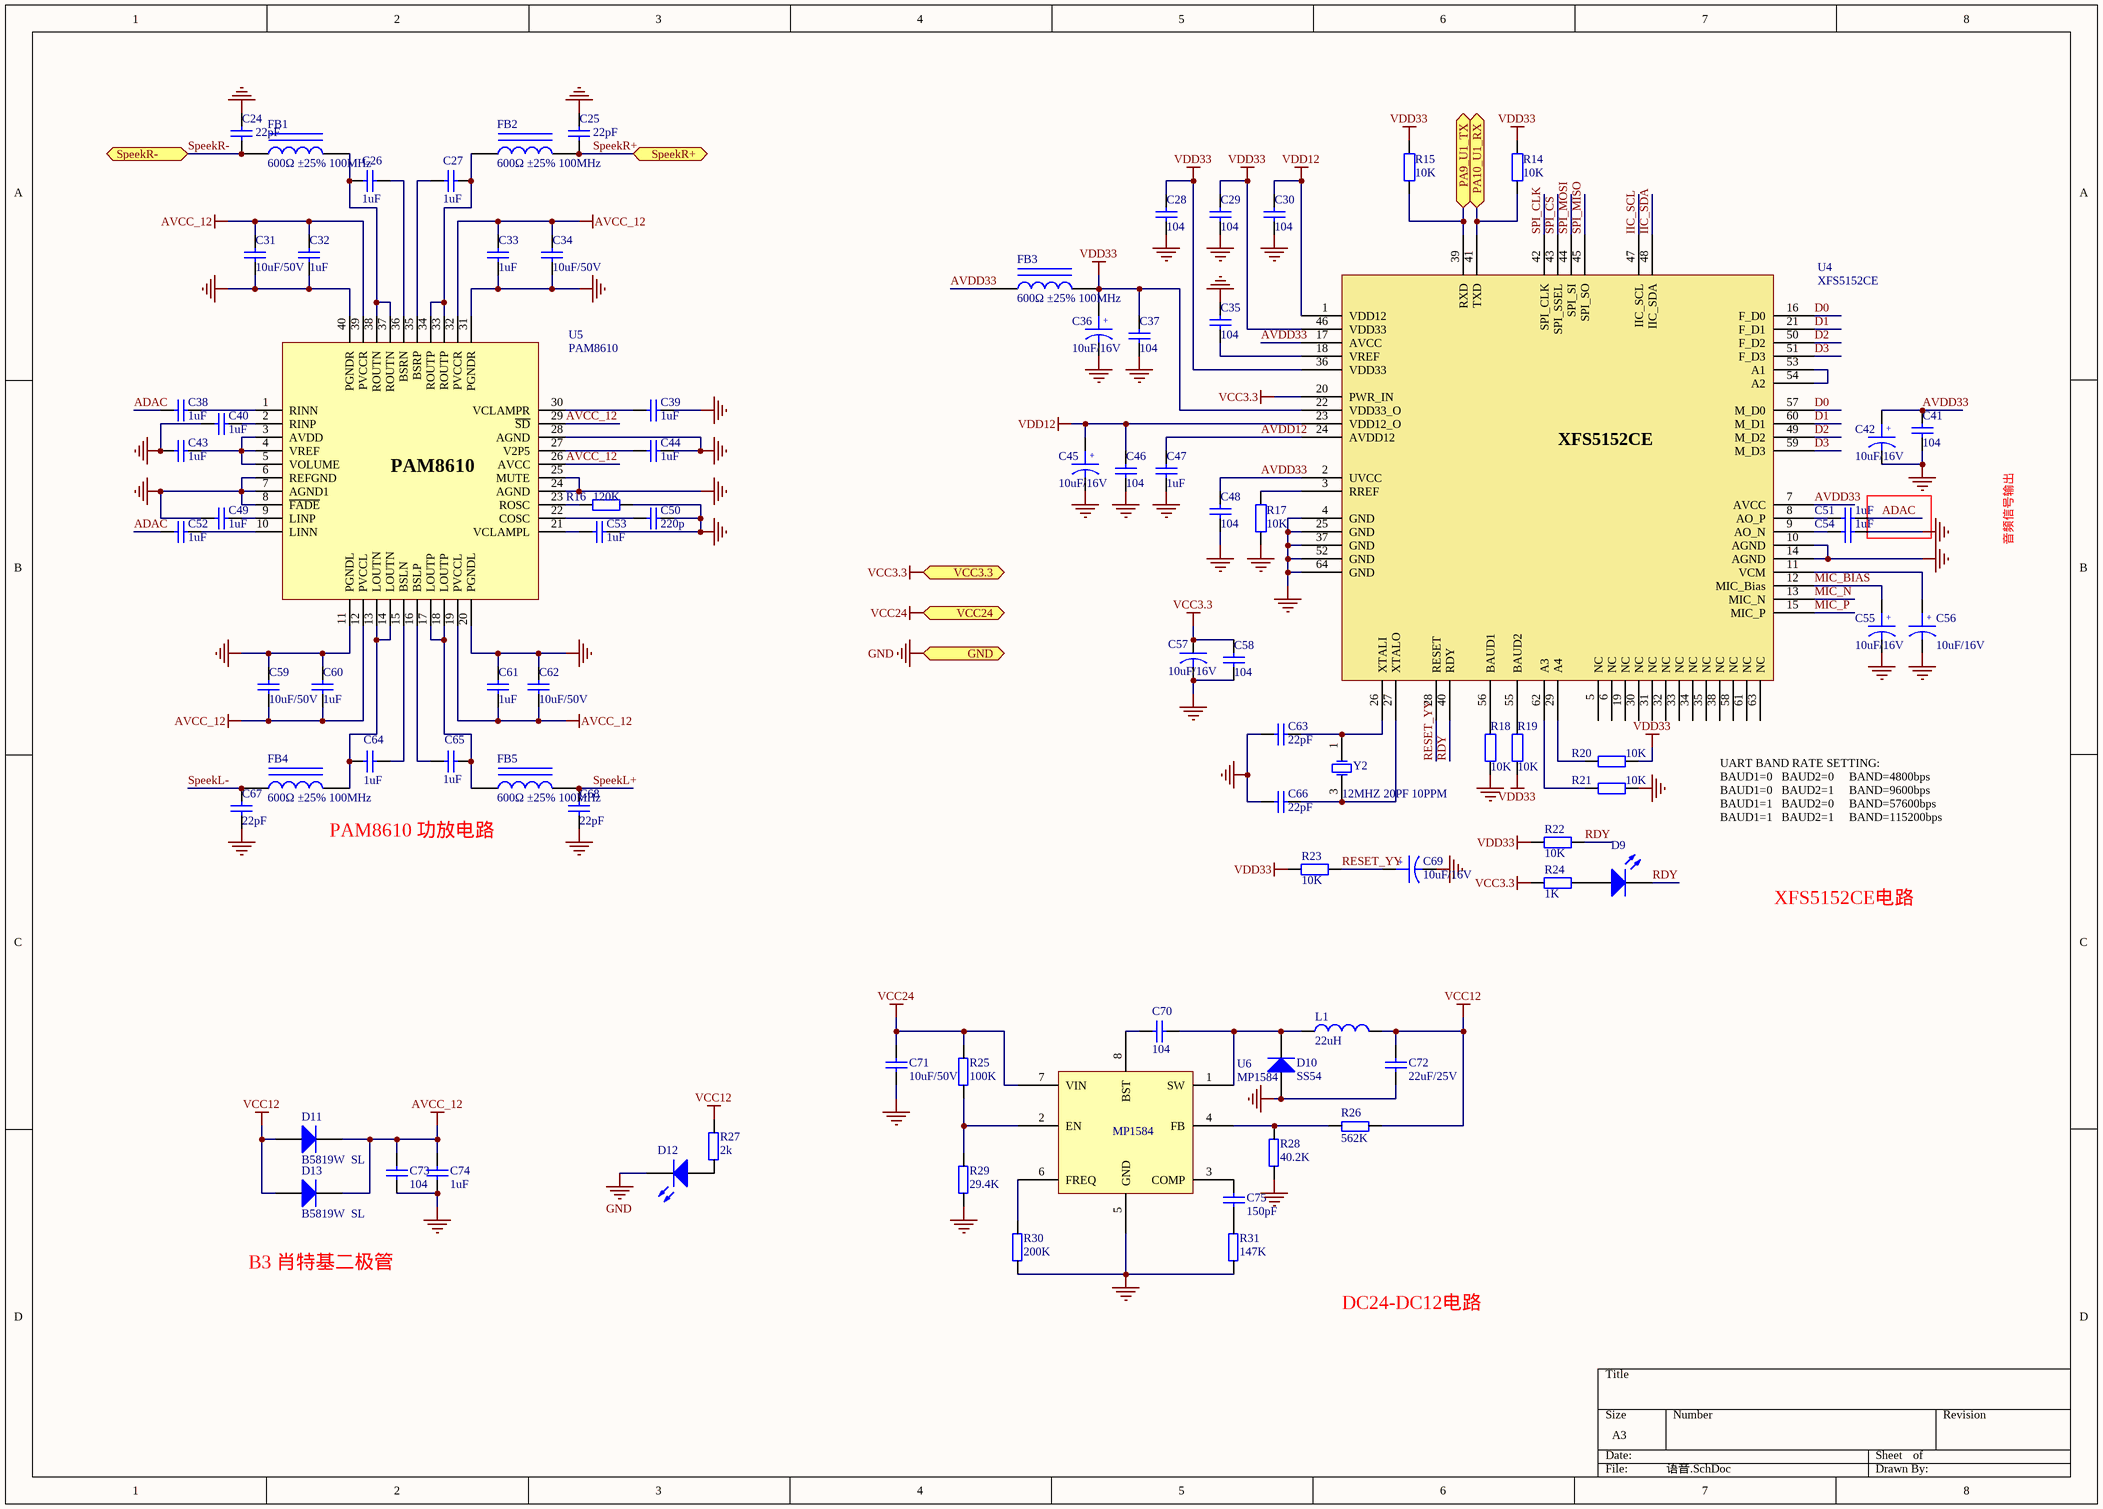
[diagram p4: 语音.SchDoc]

### Parts
C24  22pF  [0603_C]
C25  22pF  [0603_C]
C26  1uF  [0603_C]
C27  1uF  [0603_C]
C28  104  [0603_C]
C29  104  [0603_C]
C30  104  [0603_C]
C31  10uF/50V  [1206_C]
C32  1uF  [0603_C]
C33  1uF  [0603_C]
C34  10uF/50V  [1206_C]
C35  104  [0603_C]
C36  10uF/16V  [3216]
C37  104  [0603_C]
C38  1uF  [0603_C]
C39  1uF  [0603_C]
C40  1uF  [0603_C]
C41  104  [0603_C]
C42  10uF/16V  [3216]
C43  1uF  [0603_C]
C44  1uF  [0603_C]
C45  10uF/16V  [3216]
C46  104  [0603_C]
C47  1uF  [0603_C]
C48  104  [0603_C]
C49  1uF  [0603_C]
C50  220p  [0603_C]
C51  1uF  [0603_C]
C52  1uF  [0603_C]
C53  1uF  [0603_C]
C54  1uF  [0603_C]
C55  10uF/16V  [3216]
C56  10uF/16V  [3216]
C57  10uF/16V  [3216]
C58  104  [0603_C]
C59  10uF/50V  [1206_C]
C60  1uF  [0603_C]
C61  1uF  [0603_C]
C62  10uF/50V  [1206_C]
C63  22pF  [0603_C]
C64  1uF  [0603_C]
C65  1uF  [0603_C]
C66  22pF  [0603_C]
C67  22pF  [0603_C]
C68  22pF  [0603_C]
C69  10uF/16V  [3216]
C70  104  [0603_C]
C71  10uF/50V  [1206_C]
C72  22uF/25V  [0805_C]
C73  104  [0603_C]
C74  1uF  [0603_C]
C75  150pF  [0603_C]
D9  红灯 0805  [LC-0805_LED_S1]  (value not drawn)
D10  SS54  [SMA(DO-214AC)_S1]
D11  B5819W  SL  [SOD-123]
D12  蓝灯 0805  [LC-0805_LED_S1]  (value not drawn)
D13  B5819W  SL  [SOD-123]
FB1  600Ω ±25% 100MHz  [0805_L]
FB2  600Ω ±25% 100MHz  [0805_L]
FB3  600Ω ±25% 100MHz  [0805_L]
FB4  600Ω ±25% 100MHz  [0805_L]
FB5  600Ω ±25% 100MHz  [0805_L]
L1  22uH  [L-7*7*4mm-S]
R14  10K  [0603_R]
R15  10K  [0603_R]
R16  120K  [0603_R]
R17  10K  [0603_R]
R18  10K  [0603_R]
R19  10K  [0603_R]
R20  10K  [0603_R]
R21  10K  [0603_R]
R22  10K  [0603_R]
R23  10K  [0603_R]
R24  1K  [0603_R]
R25  100K  [0603_R]
R26  562K  [0603_R]
R27  2k  [0603_R]
R28  40.2K  [0603_R]
R29  29.4K  [0603_R]
R30  200K  [0603_R]
R31  147K  [0603_R]
U4  XFS5152CE  [LQFP-64_10x10x05P]
U5  PAM8610  [QFN50P600X600X80-40N]
U6  MP1584  [LC-SOIC-8_EP_150MIL]
Y2  12MHZ 20PF 10PPM  [SMD-3225_4P]

### Ports
GND, PA9_U1_TX, PA10_U1_RX, SpeekR+, SpeekR-, VCC3.3, VCC24

### Nets
AVCC_12: C31.1 C32.1 C33.1 C34.1 C59.1 C60.1 C61.1 C62.1 C73.1 C74.1 D11.2(K) D13.2(K) U5.12(PVCCL) U5.19(PVCCL) U5.26(AVCC) U5.29(~{SD}) U5.32(PVCCR) U5.39(PVCCR)
GND: C24.1 C25.1 C28.2 C29.2 C30.2 C31.2 C32.2 C33.2 C34.2 C35.1 C36.2 C37.2 C39.2 C40.1 C41.2 C42.2 C43.1 C44.2 C45.2 C46.2 C47.1 C48.2 C49.1 C50.2 C53.2 C54.1 C55.2 C56.2 C57.2 C58.2 C59.2 C60.2 C61.2 C62.2 C63.1 C66.1 C67.1 C68.1 C69.2 C71.2 C72.1 C73.2 C74.2 D10.1(A) D12.K R16.1 R17.1 R18.2 R21.1 R28.2 R29.2 R30.2 R31.2 U4.4(GND) U4.10(AGND) U4.14(AGND) U4.25(GND) U4.37(GND) U4.52(GND) U4.64(GND) U5.6(REFGND) U5.7(AGND1) U5.8(~{FADE}) U5.11(PGNDL) U5.20(PGNDL) U5.24(AGND) U5.25(MUTE) U5.28(AGND) U5.31(PGNDR) U5.40(PGNDR) U6.5(GND) ; port GND
VCC3.3: C57.1 C58.1 R24.1 U4.20(PWR_IN) ; port VCC3.3
VCC12: C72.2 D11.1(A) D13.1(A) L1.2 R26.2 R27.1
VCC24: C71.1 R25.1 U6.7(VIN) ; port VCC24
VDD12: C30.1 C45.1 C46.1 U4.1(VDD12) U4.23(VDD12_O)
VDD33: C28.1 C29.1 C36.1 C37.1 FB3.2 R14.2 R15.1 R19.2 R20.2 R22.1 R23.1 U4.22(VDD33_O) U4.36(VDD33) U4.46(VDD33)
ADAC: C38.1 C51.1 C52.1
AVDD12: C47.2 U4.24(AVDD12)
AVDD33: C41.1 C42.1 C48.1 FB3.1 U4.2(UVCC) U4.7(AVCC) U4.17(AVCC)
D0: U4.16(F_D0) U4.57(M_D0)
D1: U4.21(F_D1) U4.60(M_D1)
D2: U4.49(M_D2) U4.50(F_D2)
D3: U4.51(F_D3) U4.59(M_D3)
IIC_SCL: U4.47(IIC_SCL)
IIC_SDA: U4.48(IIC_SDA)
MIC_BIAS: C55.1 U4.12(MIC_Bias)
MIC_N: U4.13(MIC_N)
MIC_P: U4.15(MIC_P)
PA9_U1_TX: R15.2 U4.39(RXD) ; port PA9_U1_TX
PA10_U1_RX: R14.1 U4.41(TXD) ; port PA10_U1_RX
RDY: D9.K R22.2 U4.40(RDY)
RESET_YY: C69.1 R23.2 U4.28(RESET)
SpeekL+: C68.2 FB5.2
SpeekL-: C67.2 FB4.1
SpeekR+: C25.2 FB2.2 ; port SpeekR+
SpeekR-: C24.2 FB1.1 ; port SpeekR-
SPI_CLK: U4.42(SPI_CLK)
SPI_CS: U4.43(SPI_SSEL)
SPI_MISO: U4.45(SPI_SO)
SPI_MOSI: U4.44(SPI_SI)
NetC26_1: C26.1 FB1.2 U5.37(ROUTN) U5.38(ROUTN)
NetC26_2: C26.2 U5.36(BSRN)
NetC27_1: C27.1 U5.35(BSRP)
NetC27_2: C27.2 FB2.1 U5.33(ROUTP) U5.34(ROUTP)
NetC35_2: C35.2 U4.18(VREF)
NetC38_2: C38.2 U5.1(RINN)
NetC39_1: C39.1 U5.30(VCLAMPR)
NetC40_2: C40.2 U5.2(RINP)
NetC43_2: C43.2 U5.3(AVDD) U5.4(VREF) U5.5(VOLUME)
NetC44_1: C44.1 U5.27(V2P5)
NetC49_2: C49.2 U5.9(LINP)
NetC50_1: C50.1 U5.22(COSC)
NetC51_2: C51.2 U4.8(AO_P)
NetC52_2: C52.2 U5.10(LINN)
NetC53_1: C53.1 U5.21(VCLAMPL)
NetC54_2: C54.2 U4.9(AO_N)
NetC56_1: C56.1 U4.11(VCM)
NetC63_2: C63.2 U4.26(XTALI) Y2.1(OSC1)
NetC64_1: C64.1 U5.15(BSLN)
NetC64_2: C64.2 FB4.2 U5.13(LOUTN) U5.14(LOUTN)
NetC65_1: C65.1 U5.16(BSLP)
NetC65_2: C65.2 FB5.1 U5.17(LOUTP) U5.18(LOUTP)
NetC66_2: C66.2 U4.27(XTALO) Y2.3(OSC2)
NetC70_1: C70.1 D10.2(K) L1.1 U6.1(SW)
NetC70_2: C70.2 U6.8(BST)
NetC75_1: C75.1 R31.1
NetC75_2: C75.2 U6.3(COMP)
NetD9_A: D9.A R24.2
NetD12_A: D12.A R27.2
NetR16_2: R16.2 U5.23(ROSC)
NetR17_2: R17.2 U4.3(RREF)
NetR18_1: R18.1 U4.56(BAUD1)
NetR19_1: R19.1 U4.55(BAUD2)
NetR20_1: R20.1 U4.29(A4)
NetR21_2: R21.2 U4.62(A3)
NetR25_2: R25.2 R29.1 U6.2(EN)
NetR26_1: R26.1 R28.1 U6.4(FB)
NetR30_1: R30.1 U6.6(FREQ)
NetU4_53: U4.53(A1) U4.54(A2)

Not connected (* = marked no-connect by the designer): U4 5(NC) 6(NC) 19(NC) 30(NC) 31(NC) 32(NC) 33(NC) 34(NC) 35(NC) 38(NC) 58(NC) 61(NC) 63(NC)

### Notes on the sheet
- 音频信号输出
- (near FB4) PAM8610 功放电路
- UART BAND RATE SETTING:
  BAUD1=0   BAUD2=0     BAND=4800bps
  BAUD1=0   BAUD2=1     BAND=9600bps
  BAUD1=1   BAUD2=0     BAND=57600bps
  BAUD1=1   BAUD2=1     BAND=115200bps
- XFS5152CE电路
- B3 肖特基二极管
- DC24-DC12电路
- (in symbol CAP POL) +

### Library data of the parts
C24 C67 C68 = Cap Semi: Capacitor (Semiconductor SIM Model); Value: 22p; Published: 8-Jun-2000; LatestRevisionDate: 29-May-2009; LatestRevisionNote: IPC-7351 Footprint Added.; PackageReference: C1206; Publisher: Altium Limited; PackageDescription: Chip Capacitor
C25 C28-C30 C35 C37 C41 C46 C48 C58 C70 C71 C73 C75 = Cap Semi: Capacitor (Semiconductor SIM Model); Published: 8-Jun-2000; LatestRevisionDate: 29-May-2009; LatestRevisionNote: IPC-7351 Footprint Added.; PackageReference: C1206; Publisher: Altium Limited; PackageDescription: Chip Capacitor
  C25: Value: 22pF
  C28-C30 C35 C37 C41 C46 C48 C58 C70 C73: Value: 104
  C71: Value: 10uF/50V
  C75: Value: 150pF
C26 C27 C32 C33 C38-C40 C43 C44 C47 C49-C54 C60 C61 C64 C65 C74 = Cap Semi: Capacitor (Semiconductor SIM Model); Value: 105; Published: 8-Jun-2000; LatestRevisionDate: 29-May-2009; LatestRevisionNote: IPC-7351 Footprint Added.; PackageReference: C1206; Publisher: Altium Limited; PackageDescription: Chip Capacitor
C31 C34 C59 C62 C63 C66 = Cap NP: 电容; Published: 8-Jun-2000; LatestRevisionDate: 17-Jul-2002; LatestRevisionNote: Re-released for DXP Platform.; Publisher: Altium Limited
C36 C42 C45 C55 C56 C69 = CAP POL: Part package: 6032
C57 = CAPACITOR
C72 = Cap Semi: Capacitor (Semiconductor SIM Model); Value: 22uF/16V; Published: 8-Jun-2000; LatestRevisionDate: 29-May-2009; LatestRevisionNote: IPC-7351 Footprint Added.; PackageReference: C1206; Publisher: Altium Limited; PackageDescription: Chip Capacitor
D9 D12 = LED0: Typical INFRARED GaAs LED; Published: 8-Jun-2000; LatestRevisionDate: 08-Jul-2005; LatestRevisionNote: Mech Layer 1 removed.; PackageReference: LED-0; Publisher: Altium Limited; PackageDescription: LED; 2 Leads
D10 = SMA(DO-214AC) SS54: 二极管; ComponentLink1Description: 供应商链接; ComponentLink1URL: http://www.szlcsc.com/product/details_23178.html; Package: SMA(DO-214AC); Supplier: LC; SuppliersPartNumber: C22452
D11 D13 = SOD-123 B5819W  SL: 肖特基二极管; ComponentLink1Description: 供应商链接; ComponentLink1URL: http://www.szlcsc.com/product/details_9093.html; Package: SOD-123; Supplier: LC; SuppliersPartNumber: C8598
FB1-FB5 = 0805 600Ω 25% 100MHz: 贴片磁珠; ComponentLink1Description: 供应商链接; ComponentLink1URL: http://www.szlcsc.com/product/details_1369.html; Package: 0805; Supplier: LC; SuppliersPartNumber: C1017
L1 = Inductor: Code_IEC: 1005; Published: 8-Jun-2000; LatestRevisionDate: 29-May-2009; LatestRevisionNote: IPC-7351 Footprint Added.; PackageReference: 0402-A; Publisher: Altium Limited; PackageDescription: Chip Inductor; Code_JEITA: 0402; Value: 22uH
R14-R24 = Res2: Resistor; Published: 8-Jun-2000; LatestRevisionDate: 17-Jul-2002; LatestRevisionNote: Re-released for DXP Platform.; Publisher: Altium Limited
  R17: PackageReference: AXIAL-0.4; Value: 10K
  R24: PackageReference: AXIAL-0.4; Value: 1K
R25-R31 = R_2
U4 = XFS5152-2
U5 = PAM8610功放芯片
U6 = MP1584EN
Y2 = SMD-3225_4P  12MHZ 20PF 10PPM: 贴片晶振; ComponentLink1Description: 供应商链接; ComponentLink1URL: http://www.szlcsc.com/product/details_9522.html; Package: SMD-3225_4P; Supplier: LC; SuppliersPartNumber: C9002

## Sheet 端子图.SchDoc
size A4
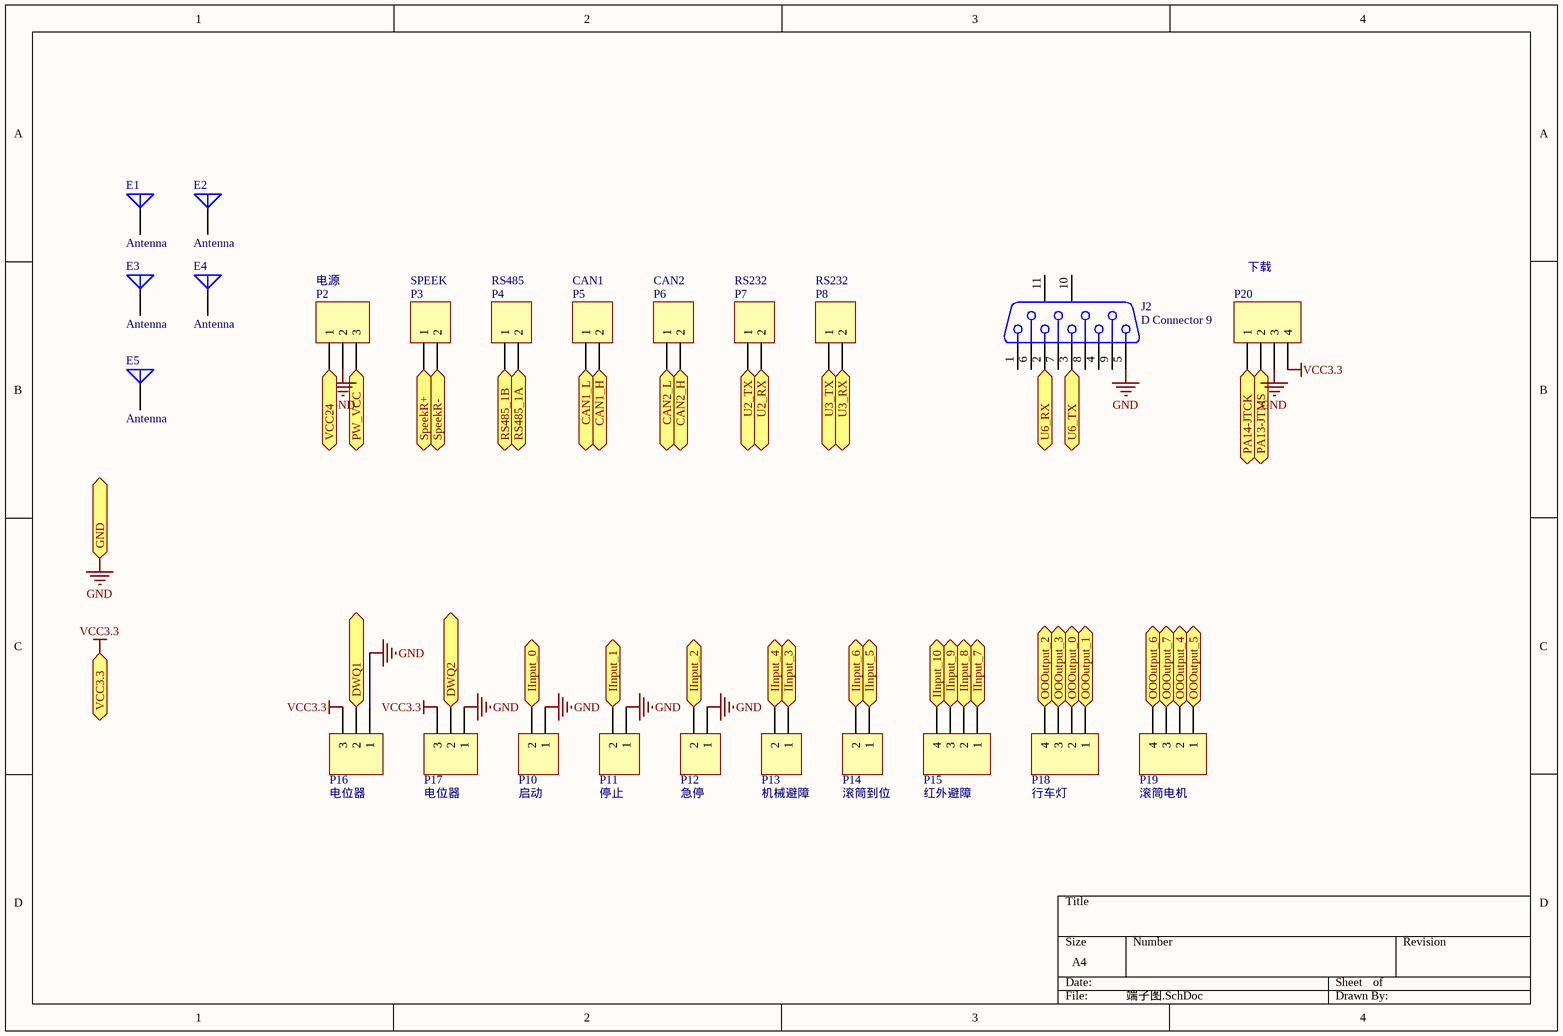
[diagram p5: 端子图.SchDoc]

### Parts
E1  Antenna  [定位孔 Φ3.2]
E2  Antenna  [定位孔 Φ3.2]
E3  Antenna  [定位孔 Φ3.2]
E4  Antenna  [定位孔 Φ3.2]
E5  Antenna  [定位孔 Φ3.2]
J2  D Connector 9  [DSUB1.385-2H9]
P2  电源  [DZ-3-5.08]
P3  SPEEK  [DZ-2-5.08]
P4  RS485  [DZ-2-5.08]
P5  CAN1  [DZ-2-5.08]
P6  CAN2  [DZ-2-5.08]
P7  RS232  [DZ-2-5.08]
P8  RS232  [DZ-2-5.08]
P10  启动  [DZ-2-5.08]
P11  停止  [DZ-2-5.08]
P12  急停  [DZ-2-5.08]
P13  机械避障  [DZ-2-5.08]
P14  滚筒到位  [DZ-2-5.08]
P15  红外避障  [DZ-4-5.08]
P16  电位器  [DZ-3-5.08]
P17  电位器  [DZ-3-5.08]
P18  行车灯  [DZ-4-5.08]
P19  滚筒电机  [DZ-4-5.08]
P20  下载  [DZ-4-5.08]

### Ports
CAN1_H, CAN1_L, CAN2_H, CAN2_L, DWQ1, DWQ2, GND, IInput_0, IInput_1, IInput_2, IInput_3, IInput_4, IInput_5, IInput_6, IInput_7, IInput_8, IInput_9, IInput_10, OOOutput_0, OOOutput_1, OOOutput_2, OOOutput_3, OOOutput_4, OOOutput_5, OOOutput_6, OOOutput_7, PA13-JTMS, PA14-JTCK, PW_VCC, RS485_1A, RS485_1B, SpeekR+, SpeekR-, U2_RX, U2_TX, U3_RX, U3_TX, U6_RX, U6_TX, VCC3.3, VCC24

### Nets
GND: J2.5 P2.2 P10.1 P11.1 P12.1 P16.1 P17.1 P20.3 ; port GND
PW_VCC: P2.3 ; port PW_VCC
VCC3.3: P16.3 P17.3 P20.4 ; port VCC3.3
VCC24: P2.1 ; port VCC24
CAN1_H: P5.2 ; port CAN1_H
CAN1_L: P5.1 ; port CAN1_L
CAN2_H: P6.2 ; port CAN2_H
CAN2_L: P6.1 ; port CAN2_L
DWQ1: P16.2 ; port DWQ1
DWQ2: P17.2 ; port DWQ2
PA13-JTMS: P20.2 ; port PA13-JTMS
PA14-JTCK: P20.1 ; port PA14-JTCK
SpeekR+: P3.1 ; port SpeekR+
SpeekR-: P3.2 ; port SpeekR-
U2_RX: P7.2 ; port U2_RX
U2_TX: P7.1 ; port U2_TX
U3_RX: P8.2 ; port U3_RX
U3_TX: P8.1 ; port U3_TX
NetD15_K: P10.2 ; port IInput_0
NetD16_K: P15.2 ; port IInput_8
NetD17_K: P11.2 ; port IInput_1
NetD18_K: P15.3 ; port IInput_9
NetD20_K: P12.2 ; port IInput_2
NetD21_K: P15.4 ; port IInput_10
NetD23_K: P13.1 ; port IInput_3
NetD26_K: P13.2 ; port IInput_4
NetD28_K: P14.1 ; port IInput_5
NetD30_K: P14.2 ; port IInput_6
NetD32_K: P15.1 ; port IInput_7
NetJ2_2: J2.2 ; port U6_RX
NetJ2_3: J2.3 ; port U6_TX
NetP4_1: P4.1 ; port RS485_1B
NetP4_2: P4.2 ; port RS485_1A
NetP18_1: P18.1 ; port OOOutput_1
NetP18_2: P18.2 ; port OOOutput_0
NetP18_3: P18.3 ; port OOOutput_3
NetP18_4: P18.4 ; port OOOutput_2
NetP19_1: P19.1 ; port OOOutput_5
NetP19_2: P19.2 ; port OOOutput_4
NetP19_3: P19.3 ; port OOOutput_7
NetP19_4: P19.4 ; port OOOutput_6

Not connected (* = marked no-connect by the designer): E1 1(A); E2 1(A); E3 1(A); E4 1(A); E5 1(A); J2 1 4 6 7 8 9 10(MH1) 11(MH2)

### Library data of the parts
E1-E5 = Antenna: Generic Antenna; Published: 24-Mar-1999; LatestRevisionDate: 17-Jul-2002; LatestRevisionNote: Re-released for DXP Platform.; PackageReference: PIN1; Publisher: Altium Limited
J2 = D Connector 9: Receptacle Assembly, 9 Position, Right Angle; PackageDocument: O; Positions: 9; Published: 15-Jun-2001; LatestRevisionDate: 17-Jul-2002; LatestRevisionNote: Re-released for DXP Platform.; DatasheetDocument: 1-Sep-1999; PackageReference: 788750; Publisher: Altium Limited; Orientation: Right Angle; Gender: Receptacle
P2 P16 P17 = Header 3: Header, 3-Pin; LatestRevisionDate: 17-Jul-2002; LatestRevisionNote: Re-released for DXP Platform.; Publisher: Altium Limited
P3-P8 P10-P14 = Header 2: Header, 2-Pin; LatestRevisionDate: 17-Jul-2002; LatestRevisionNote: Re-released for DXP Platform.; Publisher: Altium Limited
P15 P18-P20 = Header 4: Header, 4-Pin; LatestRevisionDate: 17-Jul-2002; LatestRevisionNote: Re-released for DXP Platform.; Publisher: Altium Limited

## Nets that join several sheets
GND: CPU (34 pins), 通讯外设 (18 pins), IO (23 pins), 电源 (18 pins), 语音 (71 pins), 端子图 (8 pins)
PW_VCC: 电源 (S1.1), 端子图 (P2.3)
VCC3.3: CPU (35 pins), 通讯外设 (17 pins), IO (19 pins), 电源 (5 pins), 语音 (C57.1 C58.1 R24.1 U4.20), 端子图 (P16.3 P17.3 P20.4)
VCC3.3_WIFI: 通讯外设 (R61.1 R63.1 R71.1 U35.2), 电源 (C103.1 C104.2 D35.2 U34.2)
VCC24: IO (19 pins), 电源 (6 pins), 语音 (C71.1 R25.1 U6.7), 端子图 (P2.1)
CAN1_H: 通讯外设 (R32.2 U7.7), 端子图 (P5.2)
CAN1_L: 通讯外设 (R32.1 U7.6), 端子图 (P5.1)
CAN1_RX: CPU (U1.139), 通讯外设 (U7.4)
CAN1_TX: CPU (U1.140), 通讯外设 (U7.1)
CAN2_H: 通讯外设 (R33.2 U8.7), 端子图 (P6.2)
CAN2_L: 通讯外设 (R33.1 U8.6), 端子图 (P6.1)
CAN2_RX: CPU (U1.135), 通讯外设 (U8.4)
CAN2_TX: CPU (U1.136), 通讯外设 (U8.1)
DWQ1: 电源 (U3.5), 端子图 (P16.2)
DWQ1_ADC: CPU (U1.45), 电源 (U3.6 U3.7)
DWQ2: 电源 (U3.10), 端子图 (P17.2)
DWQ2_ADC: CPU (U1.46), 电源 (U3.8 U3.9)
F_CS: CPU (U1.73), 通讯外设 (U10.1)
NetD15_K: IO (D15.K), 端子图 (P10.2)
NetD16_K: IO (D16.K), 端子图 (P15.2)
NetD17_K: IO (D17.K), 端子图 (P11.2)
NetD18_K: IO (D18.K), 端子图 (P15.3)
NetD20_K: IO (D20.K), 端子图 (P12.2)
NetD21_K: IO (D21.K), 端子图 (P15.4)
NetD23_K: IO (D23.K), 端子图 (P13.1)
NetD26_K: IO (D26.K), 端子图 (P13.2)
NetD28_K: IO (D28.K), 端子图 (P14.1)
NetD30_K: IO (D30.K), 端子图 (P14.2)
NetD32_K: IO (D32.K), 端子图 (P15.1)
NetJ2_2: 通讯外设 (U11.8), 端子图 (J2.2)
NetJ2_3: 通讯外设 (U11.7), 端子图 (J2.3)
NetP4_1: 通讯外设 (R34.1 R35.2 U12.7), 端子图 (P4.1)
NetP4_2: 通讯外设 (R35.1 R36.2 U12.6), 端子图 (P4.2)
NetP18_1: IO (U29.5 U29.6), 端子图 (P18.1)
NetP18_2: IO (U29.7 U29.8), 端子图 (P18.2)
NetP18_3: IO (U31.5 U31.6), 端子图 (P18.3)
NetP18_4: IO (U31.7 U31.8), 端子图 (P18.4)
NetP19_1: IO (R58.1 U21.4), 端子图 (P19.1)
NetP19_2: IO (R70.1 U25.4), 端子图 (P19.2)
NetP19_3: IO (R80.1 U28.4), 端子图 (P19.3)
NetP19_4: IO (R88.1 U33.4), 端子图 (P19.4)
NetR40_1: CPU (U1.56), IO (R40.1 U14.4)
NetR42_1: CPU (U1.66), IO (R42.1 U15.4)
NetR46_1: CPU (U1.57), IO (R46.1 U16.4)
NetR48_1: CPU (U1.67), IO (R48.1 U17.4)
NetR54_1: CPU (U1.58), IO (R54.1 U19.4)
NetR56_1: CPU (U1.68), IO (R56.1 U20.4)
NetR60_1: CPU (U1.59), IO (R60.1 U22.4)
NetR68_1: CPU (U1.60), IO (R68.1 U24.4)
NetR76_1: CPU (U1.63), IO (R76.1 U27.4)
NetR83_1: CPU (U1.64), IO (R83.1 U30.4)
NetR86_1: CPU (U1.65), IO (R86.1 U32.4)
NetU1_123: CPU (U1.123), IO (U23.2)
NetU1_124: CPU (U1.124), IO (U26.2)
NetU1_125: CPU (U1.125), IO (U13.2)
NetU1_126: CPU (U1.126), IO (U18.2)
NetU1_127: CPU (U1.127), IO (U21.2)
NetU1_128: CPU (U1.128), IO (U25.2)
NetU1_129: CPU (U1.129), IO (U28.2)
NetU1_132: CPU (U1.132), IO (U33.2)
PA0_485_TX1: CPU (U1.34), 通讯外设 (U12.4)
PA1_485_RX1: CPU (U1.35), 通讯外设 (U12.1)
PA2_485_RE1: CPU (U1.36), 通讯外设 (U12.2 U12.3)
PA9_U1_TX: CPU (U1.101), 语音 (R15.2 U4.39)
PA10_U1_RX: CPU (U1.102), 语音 (R14.1 U4.41)
PA13-JTMS: CPU (P1.3 R8.2 U1.105), 端子图 (P20.2)
PA14-JTCK: CPU (P1.4 R7.2 U1.109), 端子图 (P20.1)
PC6_U6_TX: CPU (U1.96), 通讯外设 (U11.10)
PC7_U6_RX: CPU (U1.97), 通讯外设 (U11.9)
PC12_U5_TX: CPU (U1.113), 通讯外设 (U35.4)
PD2_U5_RX: CPU (U1.116), 通讯外设 (U35.3)
PD5_U2_TX: CPU (U1.119), 通讯外设 (U9.11)
PD6_U2_RX: CPU (U1.122), 通讯外设 (U9.12)
PD8_U3_TX: CPU (U1.77), 通讯外设 (U9.10)
PD9_U3_RX: CPU (U1.78), 通讯外设 (U9.9)
POWER_ADC: CPU (U1.44), 电源 (U3.1 U3.2)
SpeekR+: 语音 (C25.2 FB2.2), 端子图 (P3.1)
SpeekR-: 语音 (C24.2 FB1.1), 端子图 (P3.2)
SPI2_MISO: CPU (U1.75), 通讯外设 (U10.2)
SPI2_MOSI: CPU (U1.76), 通讯外设 (U10.5)
SPI2_SCK: CPU (U1.74), 通讯外设 (U10.6)
U2_RX: 通讯外设 (U9.13), 端子图 (P7.2)
U2_TX: 通讯外设 (U9.14), 端子图 (P7.1)
U3_RX: 通讯外设 (U9.8), 端子图 (P8.2)
U3_TX: 通讯外设 (U9.7), 端子图 (P8.1)
WIFI_RESET: CPU (U1.1), 通讯外设 (U35.7)